# Altium project LPCB235__RLOOP__FCU.PrjPCB (part 5 of 7)

## Sheet LPCB235 - SPI UART - GROUP B1.SchDoc
size A3; Address1: Factory 10; Address2: 9-13 Dingley Avenue, Dandeong, VICTORIA 3175, AUSTRALIA; DocumentNumber: 36; Revision: 1; SheetNumber: 36; SheetTotal: 37; Lockie__PCB_SUB_ASSEMBLY: SPI UARTS B1; Lockie__PCB_ASSEMBLY: FCU PCB; Lockie__LDL: LPCB235; Lockie__PCB_DESCRIPTION: Flight Control Unit
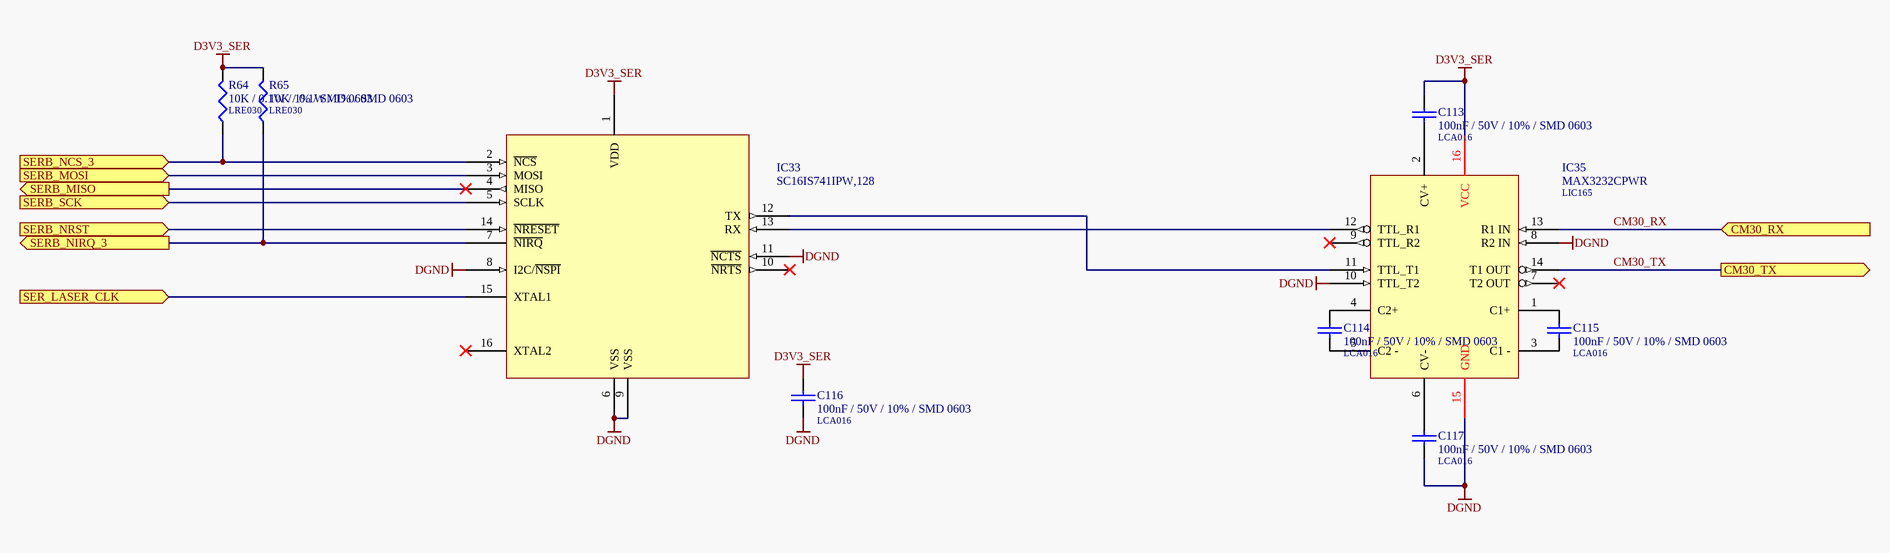
[diagram p20: LPCB235 - SPI UART - GROUP B1.SchDoc]

### Parts
C113  100nF / 50V / 10% / SMD 0603  LDL_NUMBER: LCA016  [LFP011__CC1608-0603-IPC7351_B]
C114  100nF / 50V / 10% / SMD 0603  LDL_NUMBER: LCA016  [LFP011__CC1608-0603-IPC7351_B]
C115  100nF / 50V / 10% / SMD 0603  LDL_NUMBER: LCA016  [LFP011__CC1608-0603-IPC7351_B]
C116  100nF / 50V / 10% / SMD 0603  LDL_NUMBER: LCA016  [LFP011__CC1608-0603-IPC7351_B]
C117  100nF / 50V / 10% / SMD 0603  LDL_NUMBER: LCA016  [LFP011__CC1608-0603-IPC7351_B]
IC33  SC16IS741IPW,128  [LFP049__TSSOP-16]
IC35  MAX3232CPWR  LDL_NUMBER: LIC165  [LFP049__TSSOP-16]
R64  10K / 0.1W / 1% / SMD 0603  LDL_NUMBER: LRE030  [LFP020__CR1608-0603-IPC7351_B]
R65  10K / 0.1W / 1% / SMD 0603  LDL_NUMBER: LRE030  [LFP020__CR1608-0603-IPC7351_B]

### Ports
CM30_RX (in), CM30_TX (out), SER_LASER_CLK (in), SERB_MISO (out), SERB_MOSI (in), SERB_NCS_3 (in), SERB_NIRQ_3 (out), SERB_NRST (in), SERB_SCK (in)

### Nets
D3V3_SER: C113.1 C116.1 IC33.1(VDD) IC35.16(VCC) R64.2 R65.2
DGND: C116.2 C117.2 IC33.6(VSS) IC33.8(I2C/~{NSPI}) IC33.9(VSS) IC33.11(~{NCTS}) IC35.8(R2_IN) IC35.10(TTL_T2) IC35.15(GND)
CM30_RX: IC35.13(R1_IN) ; port CM30_RX
CM30_TX: IC35.14(T1_OUT) ; port CM30_TX
SER_LASER_CLK: IC33.15(XTAL1) ; port SER_LASER_CLK
SERB_MISO: IC33.4(MISO) ; port SERB_MISO
SERB_MOSI: IC33.3(MOSI) ; port SERB_MOSI
SERB_NCS_3: IC33.2(~{NCS}) R64.1 ; port SERB_NCS_3
SERB_NIRQ_3: IC33.7(~{NIRQ}) R65.1 ; port SERB_NIRQ_3
SERB_NRST: IC33.14(~{NRESET}) ; port SERB_NRST
SERB_SCK: IC33.5(SCLK) ; port SERB_SCK
NetC113_2: C113.2 IC35.2(CV+)
NetC114_1: C114.1 IC35.4(C2+)
NetC114_2: C114.2 IC35.5(C2_-)
NetC115_1: C115.1 IC35.1(C1+)
NetC115_2: C115.2 IC35.3(C1_-)
NetC117_1: C117.1 IC35.6(CV-)
NetIC33_12: IC33.12(TX) IC35.11(TTL_T1)
NetIC33_13: IC33.13(RX) IC35.12(TTL_R1)

Not connected (* = marked no-connect by the designer): IC33 10(~{NRTS})* 16(XTAL2)*; IC35 7(T2_OUT)* 9(TTL_R2)*

### Notes on the sheet
- PCB COMPONENT DESCRIPTION
- LDL NUMBER
- Assembly Details
- Size
- Drawing File Name
- Revision
- http://rloop.org
- Scale
- A3
- Sheet Details
- N.T.S
- Sheet:
- Of:

### Library data of the parts
C113-C117 = 100nF / 50V / 10% / SMD 0603: Capacitor, Ceramic Chip, 100nF (0.1uF), 50V, 5%, SMD 0603 [LCA016]; Value: 100n; FMEDA__OPERATING__VOLTAGE_MIN: 0; FMEDA__OPERATING__VOLTAGE_MAX: 3.3; FMEDA__OPERATING__TEMP_MIN: -20; FMEDA__OPERATING__TEMP_TYP: 27; FMEDA__OPERATING__TEMP_MAX: 50; FMEDA__CHANNEL: COM; FMEDA__FUNCTION_IN_SYSTEM: *; FMEDA__OPERATING__VOLTAGE_TYP: 3.3
IC33 = SC16IS741IPW,128: IC, SPI to UART bridge [LIC472]; FMEDA__CHANNEL: COM; LDL_NUMBER: LIC472; FMEDA__FUNCTION_IN_SYSTEM: *
IC35 = MAX3232CPWR: IC, RS232 Line Driver, 3.3V, SMD TSSOP16 [LIC165]; FMEDA__OPERATING__TEMP_MAX: 50; FMEDA__OPERATING__TEMP_MIN: -20; FMEDA__OPERATING__TEMP_TYP: 27; FMEDA__CHANNEL: COM; FMEDA__OPERATING__VOLTAGE_MAX: 3.3; FMEDA__OPERATING__VOLTAGE_MIN: 0; FMEDA__FUNCTION_IN_SYSTEM: *; FMEDA__OPERATING__VOLTAGE_TYP: 3.3
R64 R65 = 10K / 0.1W / 1% / SMD 0603: Resistor, Ceramic Chip, 10K, 0.1W, 1%, SMD 0603 [LRE030]; FMEDA__OPERATING__POWER_MAX: 0; FMEDA__OPERATING__TEMP_MAX: 50; FMEDA__OPERATING__TEMP_MIN: -20; FMEDA__OPERATING__TEMP_TYP: 27; FMEDA__CHANNEL: COM; Value: 10K; FMEDA__OPERATING__POWER_MIN: 0; FMEDA__OPERATING__VOLTAGE_MAX: 0; FMEDA__OPERATING__VOLTAGE_MIN: 0; FMEDA__OPERATING__VOLTAGE_TYP: 0; FMEDA__FUNCTION_IN_SYSTEM: *

## Sheet LPCB235 - DAC.SchDoc
size A3; Address1: Factory 10; Address2: 9-13 Dingley Avenue, Dandeong, VICTORIA 3175, AUSTRALIA; DocumentNumber: 10; Revision: 1; SheetNumber: 10; SheetTotal: 37; Lockie__PCB_SUB_ASSEMBLY: DAC; Lockie__PCB_ASSEMBLY: FCU PCB; Lockie__LDL: LPCB235; Lockie__PCB_DESCRIPTION: Flight Control Unit
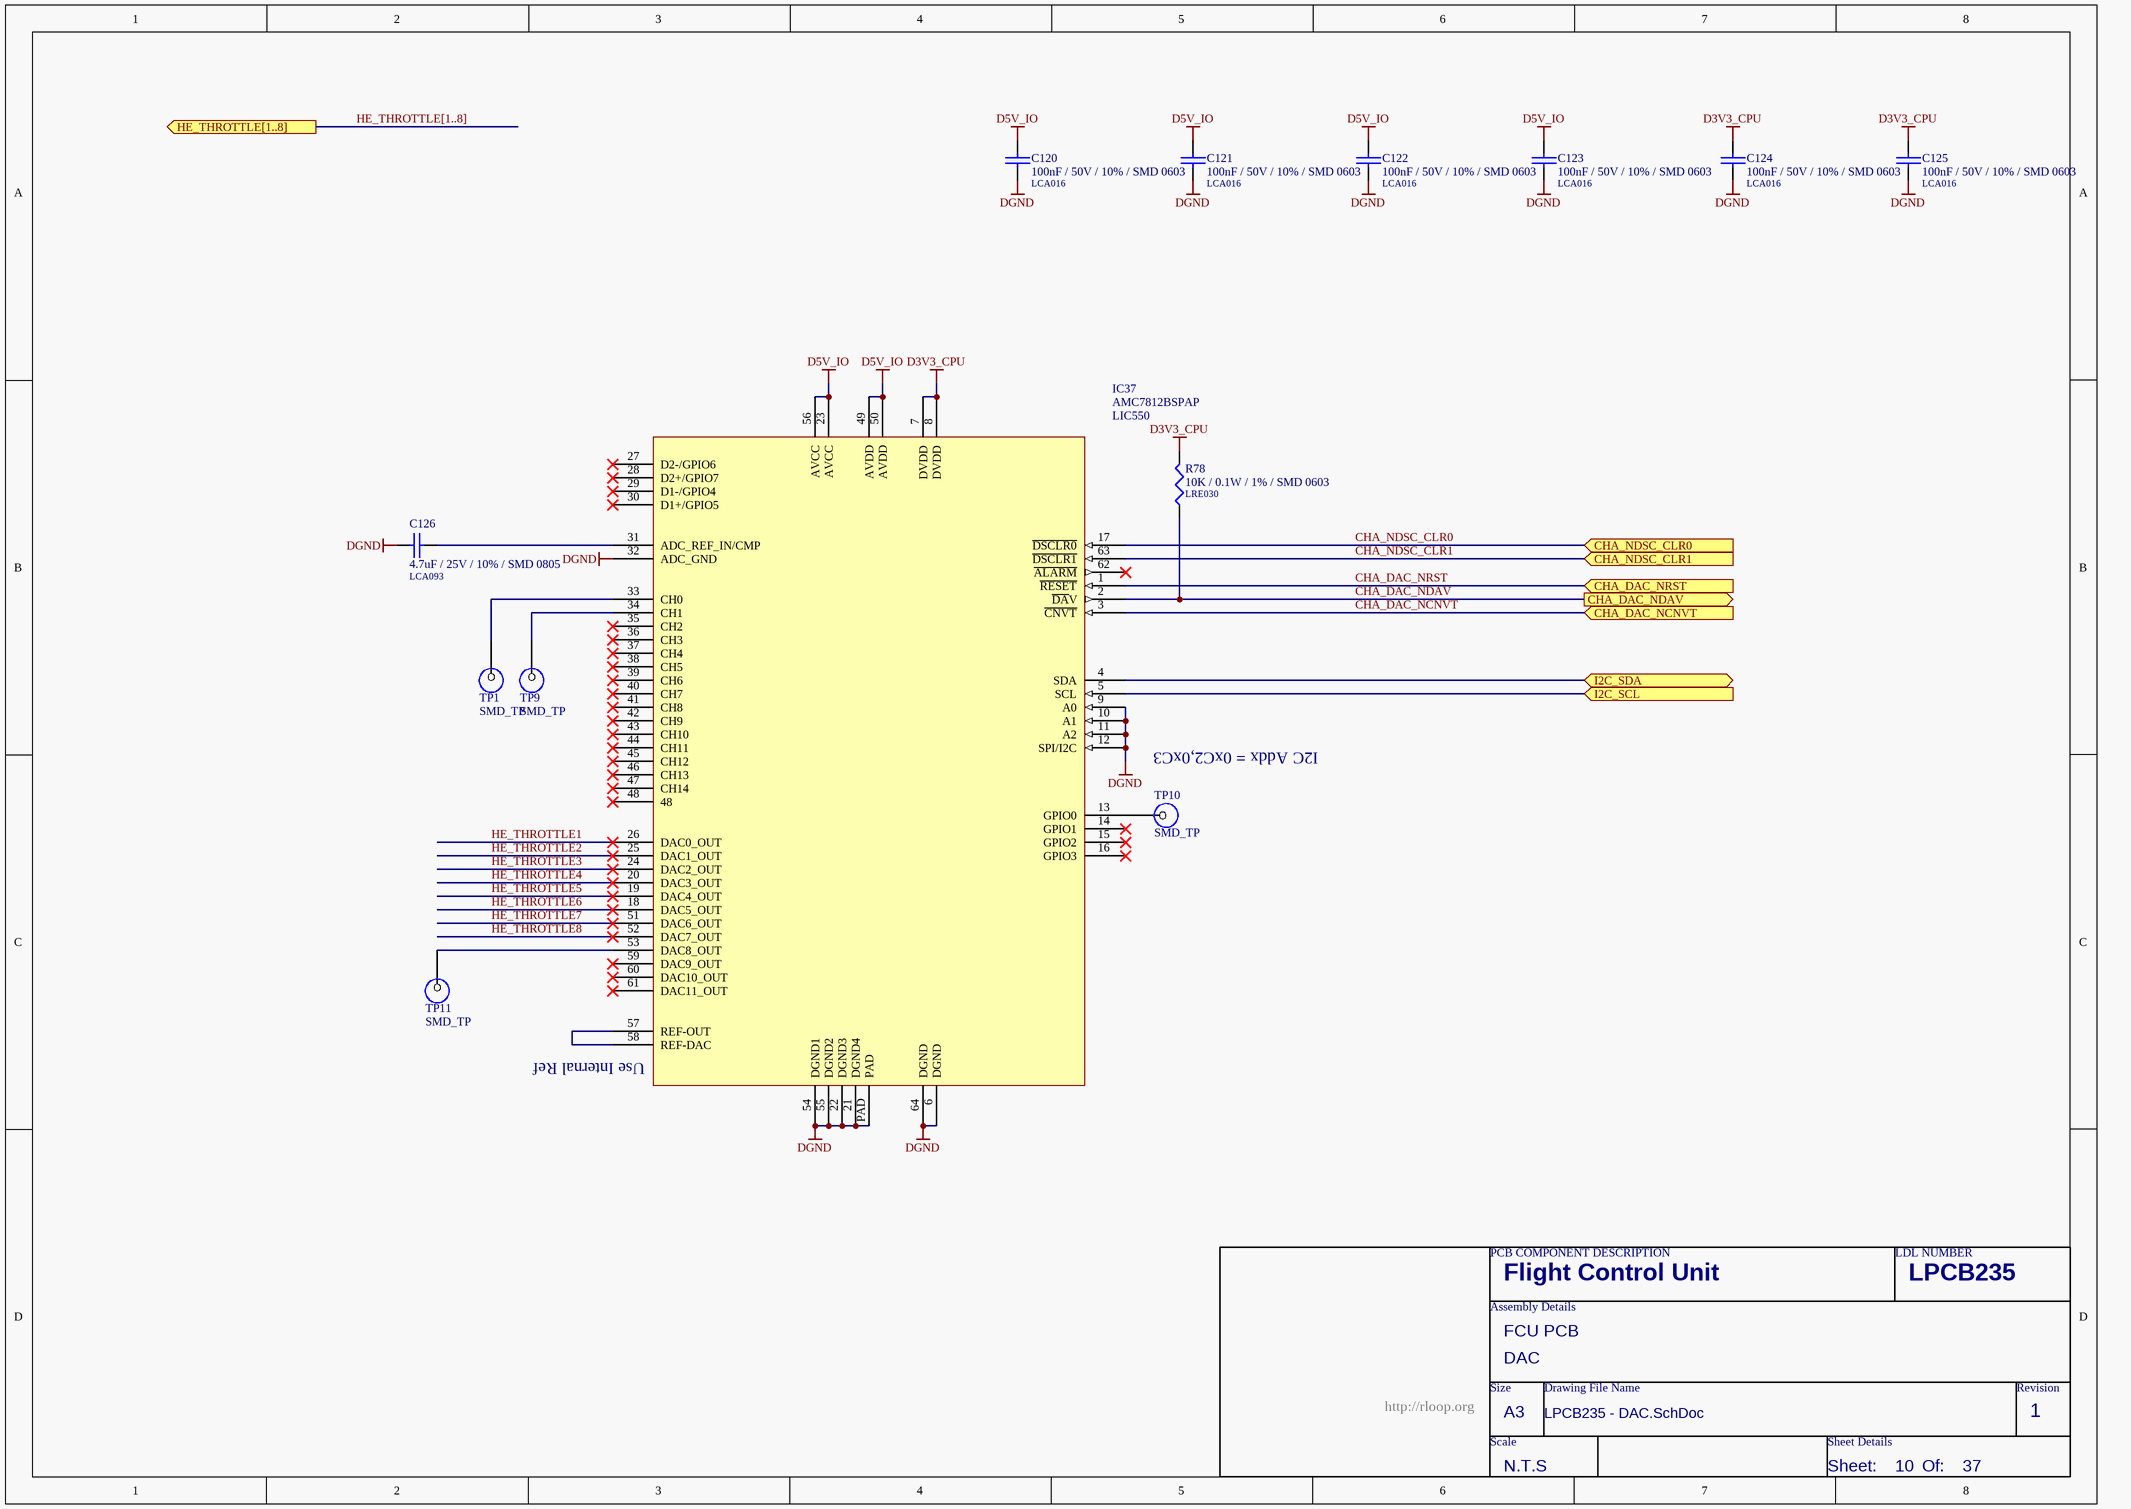
[diagram p21: LPCB235 - DAC.SchDoc]

### Parts
C120  100nF / 50V / 10% / SMD 0603  LDL_NUMBER: LCA016  [LFP011__CC1608-0603-IPC7351_B]
C121  100nF / 50V / 10% / SMD 0603  LDL_NUMBER: LCA016  [LFP011__CC1608-0603-IPC7351_B]
C122  100nF / 50V / 10% / SMD 0603  LDL_NUMBER: LCA016  [LFP011__CC1608-0603-IPC7351_B]
C123  100nF / 50V / 10% / SMD 0603  LDL_NUMBER: LCA016  [LFP011__CC1608-0603-IPC7351_B]
C124  100nF / 50V / 10% / SMD 0603  LDL_NUMBER: LCA016  [LFP011__CC1608-0603-IPC7351_B]
C125  100nF / 50V / 10% / SMD 0603  LDL_NUMBER: LCA016  [LFP011__CC1608-0603-IPC7351_B]
C126  4.7uF / 25V / 10% / SMD 0805  LDL_NUMBER: LCA093  [LFP010__CC2012-0805-IPC7351_B]
IC37  AMC7812BSPAP  LDL_NUMBER: LIC550  [LFP134__H-QFP10X10-64N]
R78  10K / 0.1W / 1% / SMD 0603  LDL_NUMBER: LRE030  [LFP020__CR1608-0603-IPC7351_B]
TP1  SMD_TP  [SMD-TP]  (no BOM)
TP9  SMD_TP  [SMD-TP]  (no BOM)
TP10  SMD_TP  [SMD-TP]  (no BOM)
TP11  SMD_TP  [SMD-TP]  (no BOM)

### Ports
CHA_DAC_NCNVT (in), CHA_DAC_NDAV (out), CHA_DAC_NRST (in), CHA_NDSC_CLR0 (in), CHA_NDSC_CLR1 (in), HE_THROTTLE[1..8] (out), I2C_SCL (in), I2C_SDA (bidir)

### Nets
D3V3_CPU: C124.1 C125.1 IC37.7(DVDD) IC37.8(DVDD) R78.2
D5V_IO: C120.1 C121.1 C122.1 C123.1 IC37.23(AVCC) IC37.49(AVDD) IC37.50(AVDD) IC37.56(AVCC)
DGND: C120.2 C121.2 C122.2 C123.2 C124.2 C125.2 C126.1 IC37.6(DGND) IC37.9(A0) IC37.10(A1) IC37.11(A2) IC37.12(SPI/I2C) IC37.21(DGND4) IC37.22(DGND3) IC37.32(ADC_GND) IC37.54(DGND1) IC37.55(DGND2) IC37.64(DGND) IC37.PAD
CHA_DAC_NCNVT: IC37.3(~{CNVT}) ; port CHA_DAC_NCNVT
CHA_DAC_NDAV: IC37.2(~{DA}V) R78.1 ; port CHA_DAC_NDAV
CHA_DAC_NRST: IC37.1(~{RESET}) ; port CHA_DAC_NRST
CHA_NDSC_CLR0: IC37.17(~{DSCLR0}) ; port CHA_NDSC_CLR0
CHA_NDSC_CLR1: IC37.63(~{DSCLR1}) ; port CHA_NDSC_CLR1
HE_THROTTLE1: IC37.26(DAC0_OUT)
HE_THROTTLE2: IC37.25(DAC1_OUT)
HE_THROTTLE3: IC37.24(DAC2_OUT)
HE_THROTTLE4: IC37.20(DAC3_OUT)
HE_THROTTLE5: IC37.19(DAC4_OUT)
HE_THROTTLE6: IC37.18(DAC5_OUT)
HE_THROTTLE7: IC37.51(DAC6_OUT)
HE_THROTTLE8: IC37.52(DAC7_OUT)
I2C_SCL: IC37.5(SCL) ; port I2C_SCL
I2C_SDA: IC37.4(SDA) ; port I2C_SDA
NetC126_2: C126.2 IC37.31(ADC_REF_IN/CMP)
NetIC37_13: IC37.13(GPIO0) TP10.1
NetIC37_33: IC37.33(CH0) TP1.1
NetIC37_34: IC37.34(CH1) TP9.1
NetIC37_53: IC37.53(DAC8_OUT) TP11.1
NetIC37_57: IC37.57(REF-OUT) IC37.58(REF-DAC)

Not connected (* = marked no-connect by the designer): IC37 14(GPIO1)* 15(GPIO2)* 16(GPIO3)* 27(D2-/GPIO6)* 28(D2+/GPIO7)* 29(D1-/GPIO4)* 30(D1+/GPIO5)* 35(CH2)* 36(CH3)* 37(CH4)* 38(CH5)* 39(CH6)* 40(CH7)* 41(CH8)* 42(CH9)* 43(CH10)* 44(CH11)* 45(CH12)* 46(CH13)* 47(CH14)* 48* 59(DAC9_OUT)* 60(DAC10_OUT)* 61(DAC11_OUT)* 62(~{ALARM})*

### Buses and harness runs
bus HE_THROTTLE[1..8] = port HE_THROTTLE[1..8]

### Notes on the sheet
- I2C Addx = 0xC2,0xC3
- (near IC37) Use Internal Ref
- PCB COMPONENT DESCRIPTION
- LDL NUMBER
- Assembly Details
- Size
- Drawing File Name
- Revision
- http://rloop.org
- Scale
- A3
- Sheet Details
- N.T.S
- Sheet:
- Of:

### Library data of the parts
C120-C125 = 100nF / 50V / 10% / SMD 0603: as C113-C117 on sheet LPCB235 - SPI UART - GROUP B1; FMEDA__FUNCTION_IN_SYSTEM: *; FMEDA__OPERATING__VOLTAGE_TYP: 3.3
C126 = 4.7uF / 25V / 10% / SMD 0805: Capacitor, Ceramic Chip, 4.7uF, 25V, 10%, SMD 0805 [LCA093]; Value: 4.7u; FMEDA__OPERATING__TEMP_MAX: 50; FMEDA__OPERATING__TEMP_MIN: -20; FMEDA__OPERATING__TEMP_TYP: 27; FMEDA__OPERATING__VOLTAGE_MAX: 0; FMEDA__CHANNEL: COM; FMEDA__OPERATING__VOLTAGE_MIN: 0; FMEDA__OPERATING__VOLTAGE_TYP: 0; FMEDA__FUNCTION_IN_SYSTEM: *
IC37 = AMC7812BSPAP: IC, ADC / DAC, SMD [LIC550]
R78 = 10K / 0.1W / 1% / SMD 0603: as R64 on sheet LPCB235 - SPI UART - GROUP B1; Value: 10K; FMEDA__OPERATING__POWER_MIN: 0; FMEDA__OPERATING__VOLTAGE_MAX: 0; FMEDA__OPERATING__VOLTAGE_MIN: 0; FMEDA__OPERATING__VOLTAGE_TYP: 0; FMEDA__FUNCTION_IN_SYSTEM: *
TP1 TP9-TP11 = SMD_TP: SMD Test Point; FMEDA__CHANNEL: COM; FMEDA__OPERATING__CURRENT_MAX: 0; FMEDA__OPERATING__TEMP_MAX: 50; FMEDA__OPERATING__TEMP_MIN: -20; FMEDA__OPERATING__TEMP_TYP: 27; FMEDA__OPERATING__VOLTAGE_MAX: 16; FMEDA__OPERATING__VOLTAGE_TYP: 12; FMEDA__OPERATING__CURRENT_MIN: 0; FMEDA__OPERATING__CURRENT_TYP: 0; FMEDA__OPERATING__VOLTAGE_MIN: 0

## Sheet LPCB235 - HE THROTTLES.SchDoc
size A3; Address1: Factory 10; Address2: 9-13 Dingley Avenue, Dandeong, VICTORIA 3175, AUSTRALIA; DocumentNumber: 12; Revision: 1; SheetNumber: 12; SheetTotal: 37; Lockie__PCB_SUB_ASSEMBLY: HE Throttle Channels; Lockie__PCB_ASSEMBLY: FCU PCB; Lockie__LDL: LPCB235; Lockie__PCB_DESCRIPTION: Flight Control Unit
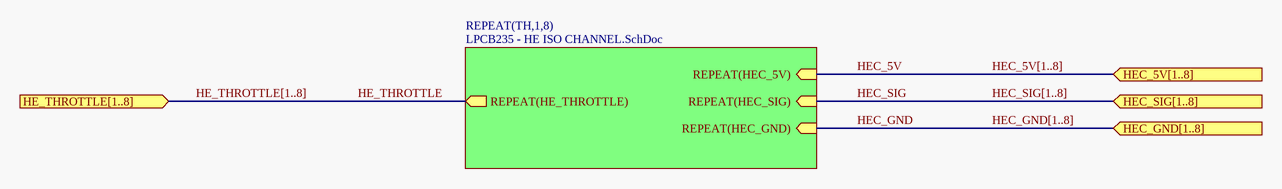
[diagram p22: LPCB235 - HE THROTTLES.SchDoc]

### Sub-sheets
REPEAT(TH,1,8) = LPCB235 - HE ISO CHANNEL.SchDoc: REPEAT(HE_THROTTLE) (out), REPEAT(HEC_5V) (in), REPEAT(HEC_GND) (in), REPEAT(HEC_SIG) (in)

### Ports
HE_THROTTLE[1..8] (in), HEC_5V[1..8] (in), HEC_GND[1..8] (in), HEC_SIG[1..8] (in)

### Nets
HE_THROTTLE: sheet REPEAT(TH,1,8)/REPEAT(HE_THROTTLE)
HEC_5V: sheet REPEAT(TH,1,8)/REPEAT(HEC_5V)
HEC_GND: sheet REPEAT(TH,1,8)/REPEAT(HEC_GND)
HEC_SIG: sheet REPEAT(TH,1,8)/REPEAT(HEC_SIG)

### Buses and harness runs
bus HE_THROTTLE[1..8] = port HE_THROTTLE[1..8]
bus HEC_5V[1..8] = port HEC_5V[1..8]
bus HEC_GND[1..8] = port HEC_GND[1..8]
bus HEC_SIG[1..8] = port HEC_SIG[1..8]

### Notes on the sheet
- PCB COMPONENT DESCRIPTION
- LDL NUMBER
- Assembly Details
- Size
- Drawing File Name
- Revision
- http://rloop.org
- Scale
- A3
- Sheet Details
- N.T.S
- Sheet:
- Of:

## Sheet LPCB235 - HE ISO CHANNEL.SchDoc
size A3; Address1: Factory 10; Address2: 9-13 Dingley Avenue, Dandeong, VICTORIA 3175, AUSTRALIA; DocumentNumber: 13; Revision: 1; SheetNumber: 13; SheetTotal: 37; Lockie__PCB_SUB_ASSEMBLY: HE Isolated Channels; Lockie__PCB_ASSEMBLY: FCU PCB; Lockie__LDL: LPCB235; Lockie__PCB_DESCRIPTION: Flight Control Unit
Used 8 times, as channels U_LPCB235 - HE THROTTLES/TH1, U_LPCB235 - HE THROTTLES/TH2, U_LPCB235 - HE THROTTLES/TH3, U_LPCB235 - HE THROTTLES/TH4, U_LPCB235 - HE THROTTLES/TH5, U_LPCB235 - HE THROTTLES/TH6, U_LPCB235 - HE THROTTLES/TH7, U_LPCB235 - HE THROTTLES/TH8. Parts and nets are listed once, with the designators drawn on the sheet.
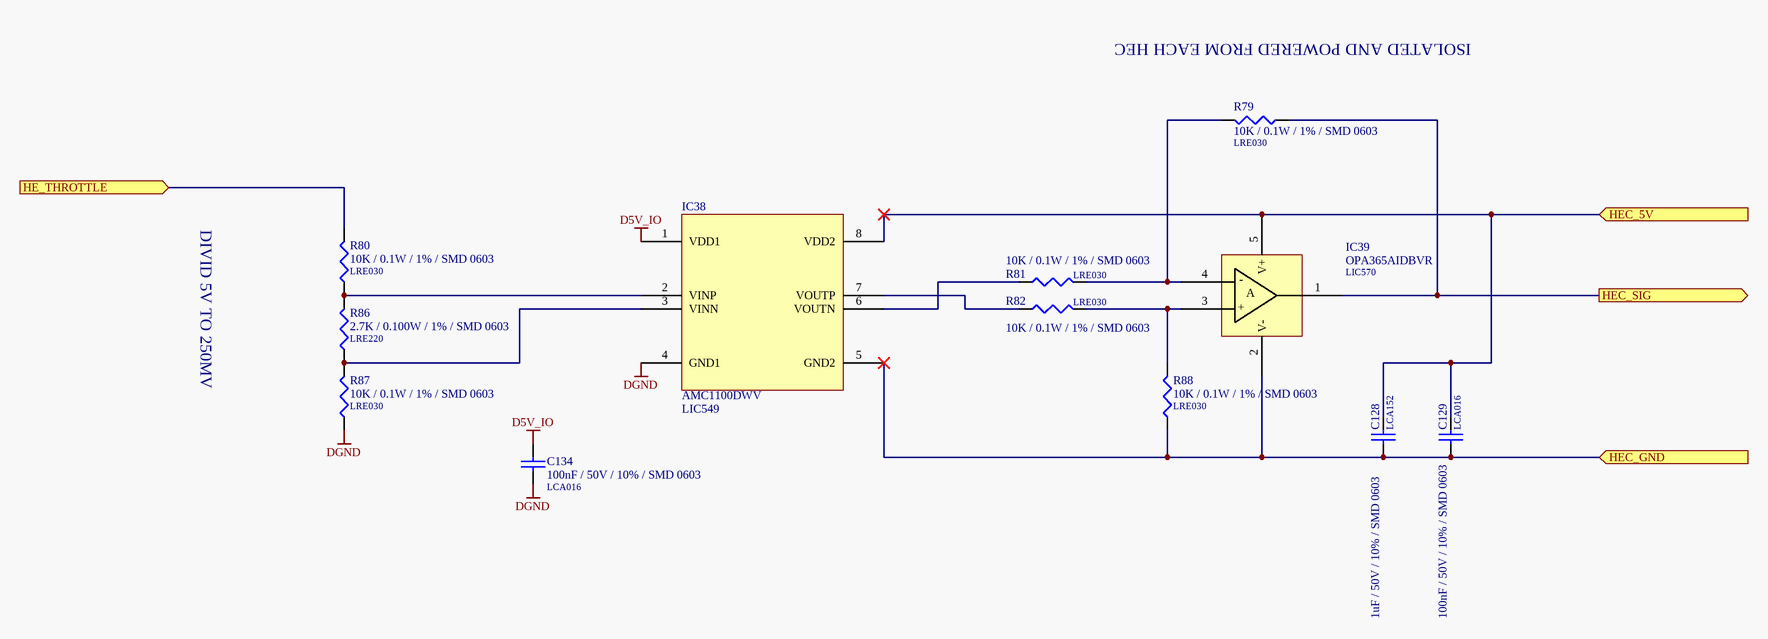
[diagram p23: LPCB235 - HE ISO CHANNEL.SchDoc]

### Parts
C128  1uF / 50V / 10% / SMD 0603  LDL_NUMBER: LCA152  [LFP011__CC1608-0603-IPC7351_B]
C129  100nF / 50V / 10% / SMD 0603  LDL_NUMBER: LCA016  [LFP011__CC1608-0603-IPC7351_B]
C134  100nF / 50V / 10% / SMD 0603  LDL_NUMBER: LCA016  [LFP011__CC1608-0603-IPC7351_B]
IC38  AMC1100DWV  LDL_NUMBER: LIC549  [LFP150__DWV0008A]
IC39  OPA365AIDBVR  LDL_NUMBER: LIC570  [LFP114__R-PDSO-G5]
R79  10K / 0.1W / 1% / SMD 0603  LDL_NUMBER: LRE030  [LFP020__CR1608-0603-IPC7351_B]
R80  10K / 0.1W / 1% / SMD 0603  LDL_NUMBER: LRE030  [LFP020__CR1608-0603-IPC7351_B]
R81  10K / 0.1W / 1% / SMD 0603  LDL_NUMBER: LRE030  [LFP020__CR1608-0603-IPC7351_B]
R82  10K / 0.1W / 1% / SMD 0603  LDL_NUMBER: LRE030  [LFP020__CR1608-0603-IPC7351_B]
R86  2.7K / 0.100W / 1% / SMD 0603  LDL_NUMBER: LRE220  [LFP020__CR1608-0603-IPC7351_B]
R87  10K / 0.1W / 1% / SMD 0603  LDL_NUMBER: LRE030  [LFP020__CR1608-0603-IPC7351_B]
R88  10K / 0.1W / 1% / SMD 0603  LDL_NUMBER: LRE030  [LFP020__CR1608-0603-IPC7351_B]

### Ports
HE_THROTTLE (in), HEC_5V (in), HEC_GND (in), HEC_SIG (out)

### Nets
D5V_IO: C134.1 IC38.1(VDD1)
DGND: C134.2 IC38.4(GND1) R87.1
HE_THROTTLE: R80.2 ; port HE_THROTTLE
HEC_5V: C128.1 C129.1 IC38.8(VDD2) IC39.5(V+) ; port HEC_5V
HEC_GND: C128.2 C129.2 IC38.5(GND2) IC39.2(V-) R88.1 ; port HEC_GND
HEC_SIG: IC39.1(OUT_A) R79.1 ; port HEC_SIG
NetIC38_2: IC38.2(VINP) R80.1 R86.2
NetIC38_3: IC38.3(VINN) R86.1 R87.2
NetIC38_6: IC38.6(VOUTN) R81.1
NetIC38_7: IC38.7(VOUTP) R82.1
NetIC39_3: IC39.3(+IN_A) R82.2 R88.2
NetIC39_4: IC39.4(-IN_A) R79.2 R81.2

### Channels
U_LPCB235 - HE THROTTLES/TH1: designators end in _TH1; ports HE_THROTTLE=HE_THROTTLE1 HEC_5V=HEC_5V1 HEC_GND=HEC_GND1 HEC_SIG=HEC_SIG1
U_LPCB235 - HE THROTTLES/TH2: designators end in _TH2; ports HE_THROTTLE=HE_THROTTLE2 HEC_5V=HEC_5V2 HEC_GND=HEC_GND2 HEC_SIG=HEC_SIG2
U_LPCB235 - HE THROTTLES/TH3: designators end in _TH3; ports HE_THROTTLE=HE_THROTTLE3 HEC_5V=HEC_5V3 HEC_GND=HEC_GND3 HEC_SIG=HEC_SIG3
U_LPCB235 - HE THROTTLES/TH4: designators end in _TH4; ports HE_THROTTLE=HE_THROTTLE4 HEC_5V=HEC_5V4 HEC_GND=HEC_GND4 HEC_SIG=HEC_SIG4
U_LPCB235 - HE THROTTLES/TH5: designators end in _TH5; ports HE_THROTTLE=HE_THROTTLE5 HEC_5V=HEC_5V5 HEC_GND=HEC_GND5 HEC_SIG=HEC_SIG5
U_LPCB235 - HE THROTTLES/TH6: designators end in _TH6; ports HE_THROTTLE=HE_THROTTLE6 HEC_5V=HEC_5V6 HEC_GND=HEC_GND6 HEC_SIG=HEC_SIG6
U_LPCB235 - HE THROTTLES/TH7: designators end in _TH7; ports HE_THROTTLE=HE_THROTTLE7 HEC_5V=HEC_5V7 HEC_GND=HEC_GND7 HEC_SIG=HEC_SIG7
U_LPCB235 - HE THROTTLES/TH8: designators end in _TH8; ports HE_THROTTLE=HE_THROTTLE8 HEC_5V=HEC_5V8 HEC_GND=HEC_GND8 HEC_SIG=HEC_SIG8

### Notes on the sheet
- ISOLATED AND POWERED FROM EACH HEC
- DIVID 5V TO 250MV
- PCB COMPONENT DESCRIPTION
- LDL NUMBER
- Assembly Details
- Size
- Drawing File Name
- Revision
- http://rloop.org
- Scale
- A3
- Sheet Details
- N.T.S
- Sheet:
- Of:
- (in symbol OPA365AIDBVR) -; A; +

### Library data of the parts
C128 = 1uF / 50V / 10% / SMD 0603: Capacitor, Ceramic Chip, 1uF, 50V, 10% (X5R), SMD 0603 [LCA152]; Value: 1u; FMEDA__OPERATING__VOLTAGE_MAX: 50; FMEDA__OPERATING__VOLTAGE_MIN: 0; FMEDA__OPERATING__TEMP_MAX: 85; FMEDA__OPERATING__TEMP_MIN: -55; FMEDA__OPERATING__TEMP_TYP: 27; FMEDA__CHANNEL: COM; FMEDA__OPERATING__VOLTAGE_TYP: 0; FMEDA__FUNCTION_IN_SYSTEM: *
C129 C134 = 100nF / 50V / 10% / SMD 0603: as C113-C117 on sheet LPCB235 - SPI UART - GROUP B1; FMEDA__FUNCTION_IN_SYSTEM: *; FMEDA__OPERATING__VOLTAGE_TYP: 3.3
IC38 = AMC1100DWV: IC, Isolation Amplifier, SMD SOIC8 [LIC549]
IC39 = OPA365AIDBVR: IC, OpAmp, 1-Channel, Low Noise, SMD SOT-23-5 [LIC570]; FMEDA__OPERATING__TEMP_MAX: 125; FMEDA__OPERATING__TEMP_MIN: -40; FMEDA__OPERATING__TEMP_TYP: 27; FMEDA__CHANNEL: COM; FMEDA__FUNCTION_IN_SYSTEM: *
R79-R82 R87 R88 = 10K / 0.1W / 1% / SMD 0603: as R64 on sheet LPCB235 - SPI UART - GROUP B1; Value: 10K; FMEDA__OPERATING__POWER_MIN: 0; FMEDA__OPERATING__VOLTAGE_MAX: 0; FMEDA__OPERATING__VOLTAGE_MIN: 0; FMEDA__OPERATING__VOLTAGE_TYP: 0; FMEDA__FUNCTION_IN_SYSTEM: *
R86 = 2.7K / 0.100W / 1% / SMD 0603: Resistor, Thick Film, 2.7K, 0.100W, 75V, 1%, SMD 0603 [LRE220]; FMEDA__OPERATING__POWER_MAX: 0.1; FMEDA__OPERATING__POWER_MIN: 0; FMEDA__OPERATING__VOLTAGE_MAX: 75; FMEDA__OPERATING__TEMP_MAX: 155; FMEDA__OPERATING__TEMP_MIN: -55; FMEDA__OPERATING__TEMP_TYP: 27; FMEDA__CHANNEL: COM; VALUE: 2.7K; FMEDA__OPERATING__VOLTAGE_MIN: 0; FMEDA__OPERATING__VOLTAGE_TYP: 75; FMEDA__FUNCTION_IN_SYSTEM: *

## Sheet LPCB235 - WATCHDOG.SchDoc
size A3; Address1: Factory 10; Address2: 9-13 Dingley Avenue, Dandeong, VICTORIA 3175, AUSTRALIA; DocumentNumber: 37; Revision: 1; SheetNumber: 37; SheetTotal: 37; Lockie__PCB_SUB_ASSEMBLY: Watchdog; Lockie__PCB_ASSEMBLY: FCU PCB; Lockie__LDL: LPCB235; Lockie__PCB_DESCRIPTION: Flight Control Unit
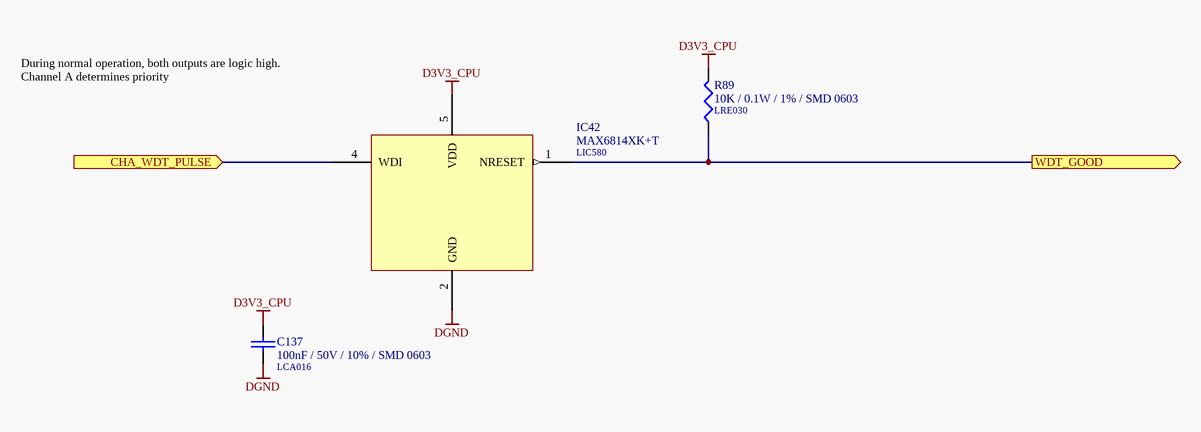
[diagram p24: LPCB235 - WATCHDOG.SchDoc]

### Parts
C137  100nF / 50V / 10% / SMD 0603  LDL_NUMBER: LCA016  [LFP011__CC1608-0603-IPC7351_B]
IC42  MAX6814XK+T  LDL_NUMBER: LIC580  [LFP047__SOT353]
R89  10K / 0.1W / 1% / SMD 0603  LDL_NUMBER: LRE030  [LFP020__CR1608-0603-IPC7351_B]

### Ports
CHA_WDT_PULSE (in), WDT_GOOD (out)

### Nets
D3V3_CPU: C137.1 IC42.5(VDD) R89.2
DGND: C137.2 IC42.2(GND)
CHA_WDT_PULSE: IC42.4(WDI) ; port CHA_WDT_PULSE
WDT_GOOD: IC42.1(NRESET) R89.1 ; port WDT_GOOD

### Notes on the sheet
- During normal operation, both outputs are logic high.
  Channel A determines priority
- PCB COMPONENT DESCRIPTION
- LDL NUMBER
- Assembly Details
- Size
- Drawing File Name
- Revision
- http://rloop.org
- Scale
- A3
- Sheet Details
- N.T.S
- Sheet:
- Of:

### Library data of the parts
C137 = 100nF / 50V / 10% / SMD 0603: as C113-C117 on sheet LPCB235 - SPI UART - GROUP B1; FMEDA__FUNCTION_IN_SYSTEM: *; FMEDA__OPERATING__VOLTAGE_TYP: 3.3
IC42 = MAX6814XK+T: IC, Watchdog, SMD [LIC580]; FMEDA__OPERATING__TEMP_MIN: -20; FMEDA__OPERATING__TEMP_TYP: 27; FMEDA__OPERATING__TEMP_MAX: 50; FMEDA__OPERATING__VOLTAGE_MIN: 0; FMEDA__OPERATING__VOLTAGE_TYP: 3.3; FMEDA__CHANNEL: COM; FMEDA__FUNCTION_IN_SYSTEM: *; FMEDA__OPERATING__VOLTAGE_MAX: 3.3
R89 = 10K / 0.1W / 1% / SMD 0603: as R64 on sheet LPCB235 - SPI UART - GROUP B1; Value: 10K; FMEDA__OPERATING__POWER_MIN: 0; FMEDA__OPERATING__VOLTAGE_MAX: 0; FMEDA__OPERATING__VOLTAGE_MIN: 0; FMEDA__OPERATING__VOLTAGE_TYP: 0; FMEDA__FUNCTION_IN_SYSTEM: *

## Sheet LPCB235 - BRAKE FAILSAFE.SchDoc
size A3; Address1: Factory 10; Address2: 9-13 Dingley Avenue, Dandeong, VICTORIA 3175, AUSTRALIA; DocumentNumber: 7; Revision: 1; SheetNumber: 7; SheetTotal: 37; Lockie__PCB_SUB_ASSEMBLY: Brake Failsafe System; Lockie__PCB_ASSEMBLY: FCU PCB; Lockie__LDL: LPCB235; Lockie__PCB_DESCRIPTION: Flight Control Unit
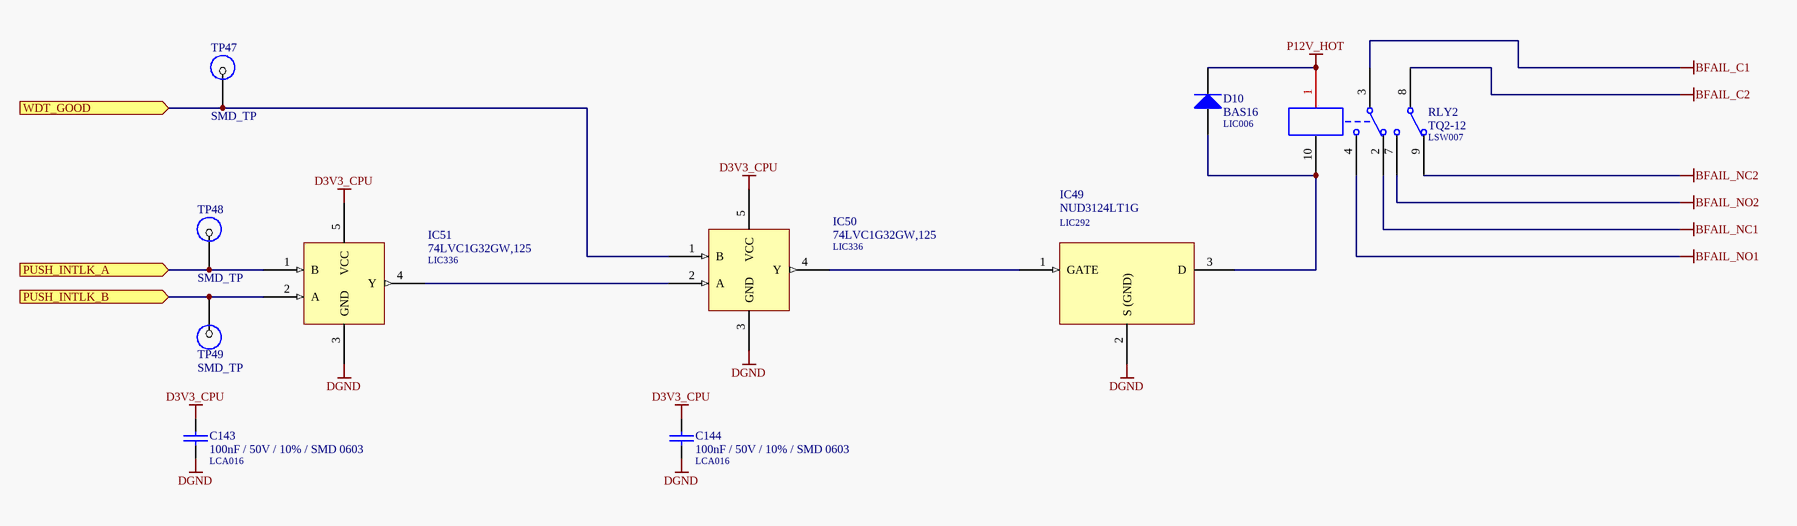
[diagram p25: LPCB235 - BRAKE FAILSAFE.SchDoc]

### Parts
C143  100nF / 50V / 10% / SMD 0603  LDL_NUMBER: LCA016  [LFP011__CC1608-0603-IPC7351_B]
C144  100nF / 50V / 10% / SMD 0603  LDL_NUMBER: LCA016  [LFP011__CC1608-0603-IPC7351_B]
D10  BAS16  LDL_NUMBER: LIC006  [LFP021__SOT23]
IC49  NUD3124LT1G  LDL_NUMBER: LIC292  [LFP021__SOT23]
IC50  74LVC1G32GW,125  LDL_NUMBER: LIC336  [LFP047__SOT353]
IC51  74LVC1G32GW,125  LDL_NUMBER: LIC336  [LFP047__SOT353]
RLY2  TQ2-12  LDL_NUMBER: LSW007  [TQ2]
TP47  SMD_TP  [SMD-TP]  (no BOM)
TP48  SMD_TP  [SMD-TP]  (no BOM)
TP49  SMD_TP  [SMD-TP]  (no BOM)

### Ports
PUSH_INTLK_A (in), PUSH_INTLK_B (in), WDT_GOOD (in)

### Nets
BFAIL_C1: RLY2.3
BFAIL_C2: RLY2.8
BFAIL_NC1: RLY2.2
BFAIL_NC2: RLY2.9
BFAIL_NO1: RLY2.4
BFAIL_NO2: RLY2.7
D3V3_CPU: C143.1 C144.1 IC50.5(VCC) IC51.5(VCC)
DGND: C143.2 C144.2 IC49.2(S_(GND)) IC50.3(GND) IC51.3(GND)
P12V_HOT: D10.3(K) RLY2.1
PUSH_INTLK_A: IC51.1(B) TP48.1 ; port PUSH_INTLK_A
PUSH_INTLK_B: IC51.2(A) TP49.1 ; port PUSH_INTLK_B
WDT_GOOD: IC50.1(B) TP47.1 ; port WDT_GOOD
NetD10_1: D10.1(A) IC49.3(D) RLY2.10
NetIC49_1: IC49.1(GATE) IC50.4(Y)
NetIC50_2: IC50.2(A) IC51.4(Y)

### Notes on the sheet
- PCB COMPONENT DESCRIPTION
- LDL NUMBER
- Assembly Details
- Size
- Drawing File Name
- Revision
- http://rloop.org
- Scale
- A3
- Sheet Details
- N.T.S
- Sheet:
- Of:

### Library data of the parts
C143 C144 = 100nF / 50V / 10% / SMD 0603: as C113-C117 on sheet LPCB235 - SPI UART - GROUP B1; FMEDA__FUNCTION_IN_SYSTEM: *; FMEDA__OPERATING__VOLTAGE_TYP: 3.3
D10 = BAS16: Diode, Small Signal, 0.2A, 85V, SMD SOT-23 [LIC006]; FMEDA__OPERATING__CURRENT_MIN: 0; FMEDA__OPERATING__TEMP_MIN: -20; FMEDA__OPERATING__TEMP_TYP: 27; FMEDA__OPERATING__TEMP_MAX: 50; FMEDA__CHANNEL: COM; FMEDA__OPERATING__CURRENT_MAX: 0; FMEDA__OPERATING__VOLTAGE_MIN: 0; FMEDA__OPERATING__VOLTAGE_MAX: 0; FMEDA__FUNCTION_IN_SYSTEM: *; FMEDA__OPERATING__CURRENT_TYP: 0; FMEDA__OPERATING__VOLTAGE_TYP: 0
IC49 = NUD3124LT1G: IC, Relay Driver, 28V Industrial, SMD SOT23 [LIC292]; FMEDA__OPERATING__TEMP_MIN: -20; FMEDA__OPERATING__TEMP_TYP: 27; FMEDA__OPERATING__TEMP_MAX: 50; FMEDA__OPERATING__VOLTAGE_MIN: 0; FMEDA__OPERATING__VOLTAGE_TYP: 13; FMEDA__OPERATING__VOLTAGE_MAX: 18; FMEDA__OPERATING__POWER_TYP: 0.1; FMEDA__OPERATING__POWER_MAX: 0.15; FMEDA__CHANNEL: COM; FMEDA__FUNCTION_IN_SYSTEM: *; FMEDA__OPERATING__POWER_MIN: 0
IC50 IC51 = 74LVC1G32GW,125: IC, Logic OR Gate, Single 2 Input, SMD SOT353 [LIC336]; FMEDA__OPERATING__TEMP_MAX: 50; FMEDA__OPERATING__TEMP_MIN: -20; FMEDA__OPERATING__TEMP_TYP: 27; FMEDA__OPERATING__VOLTAGE_MAX: 0; FMEDA__CHANNEL: COM; FMEDA__FUNCTION_IN_SYSTEM: *; FMEDA__OPERATING__VOLTAGE_MIN: 0; FMEDA__OPERATING__VOLTAGE_TYP: 0
RLY2 = TQ2-12: Relay, DPDT, Non Latching, 12VDC Coil, 2A Rating, PTH; FMEDA__CHANNEL: COM; FMEDA__OPERATING__TEMP_MAX: 50; FMEDA__OPERATING__TEMP_MIN: -20; FMEDA__OPERATING__TEMP_TYP: 27; Revision: July-2002: Re-released for DXP Platform.
TP47-TP49 = SMD_TP: as TP1 on sheet LPCB235 - DAC; FMEDA__OPERATING__CURRENT_MIN: 0; FMEDA__OPERATING__CURRENT_TYP: 0; FMEDA__OPERATING__VOLTAGE_MIN: 0

## Sheet LPCB235 - ANALOG CONNECTOR.SchDoc
size A3; Address1: Factory 10; Address2: 9-13 Dingley Avenue, Dandeong, VICTORIA 3175, AUSTRALIA; DocumentNumber: 2; Revision: 1; SheetNumber: 2; SheetTotal: 37; Lockie__PCB_SUB_ASSEMBLY: Connector; Lockie__PCB_ASSEMBLY: FCU PCB; Lockie__LDL: LPCB235; Lockie__PCB_DESCRIPTION: Flight Control Unit
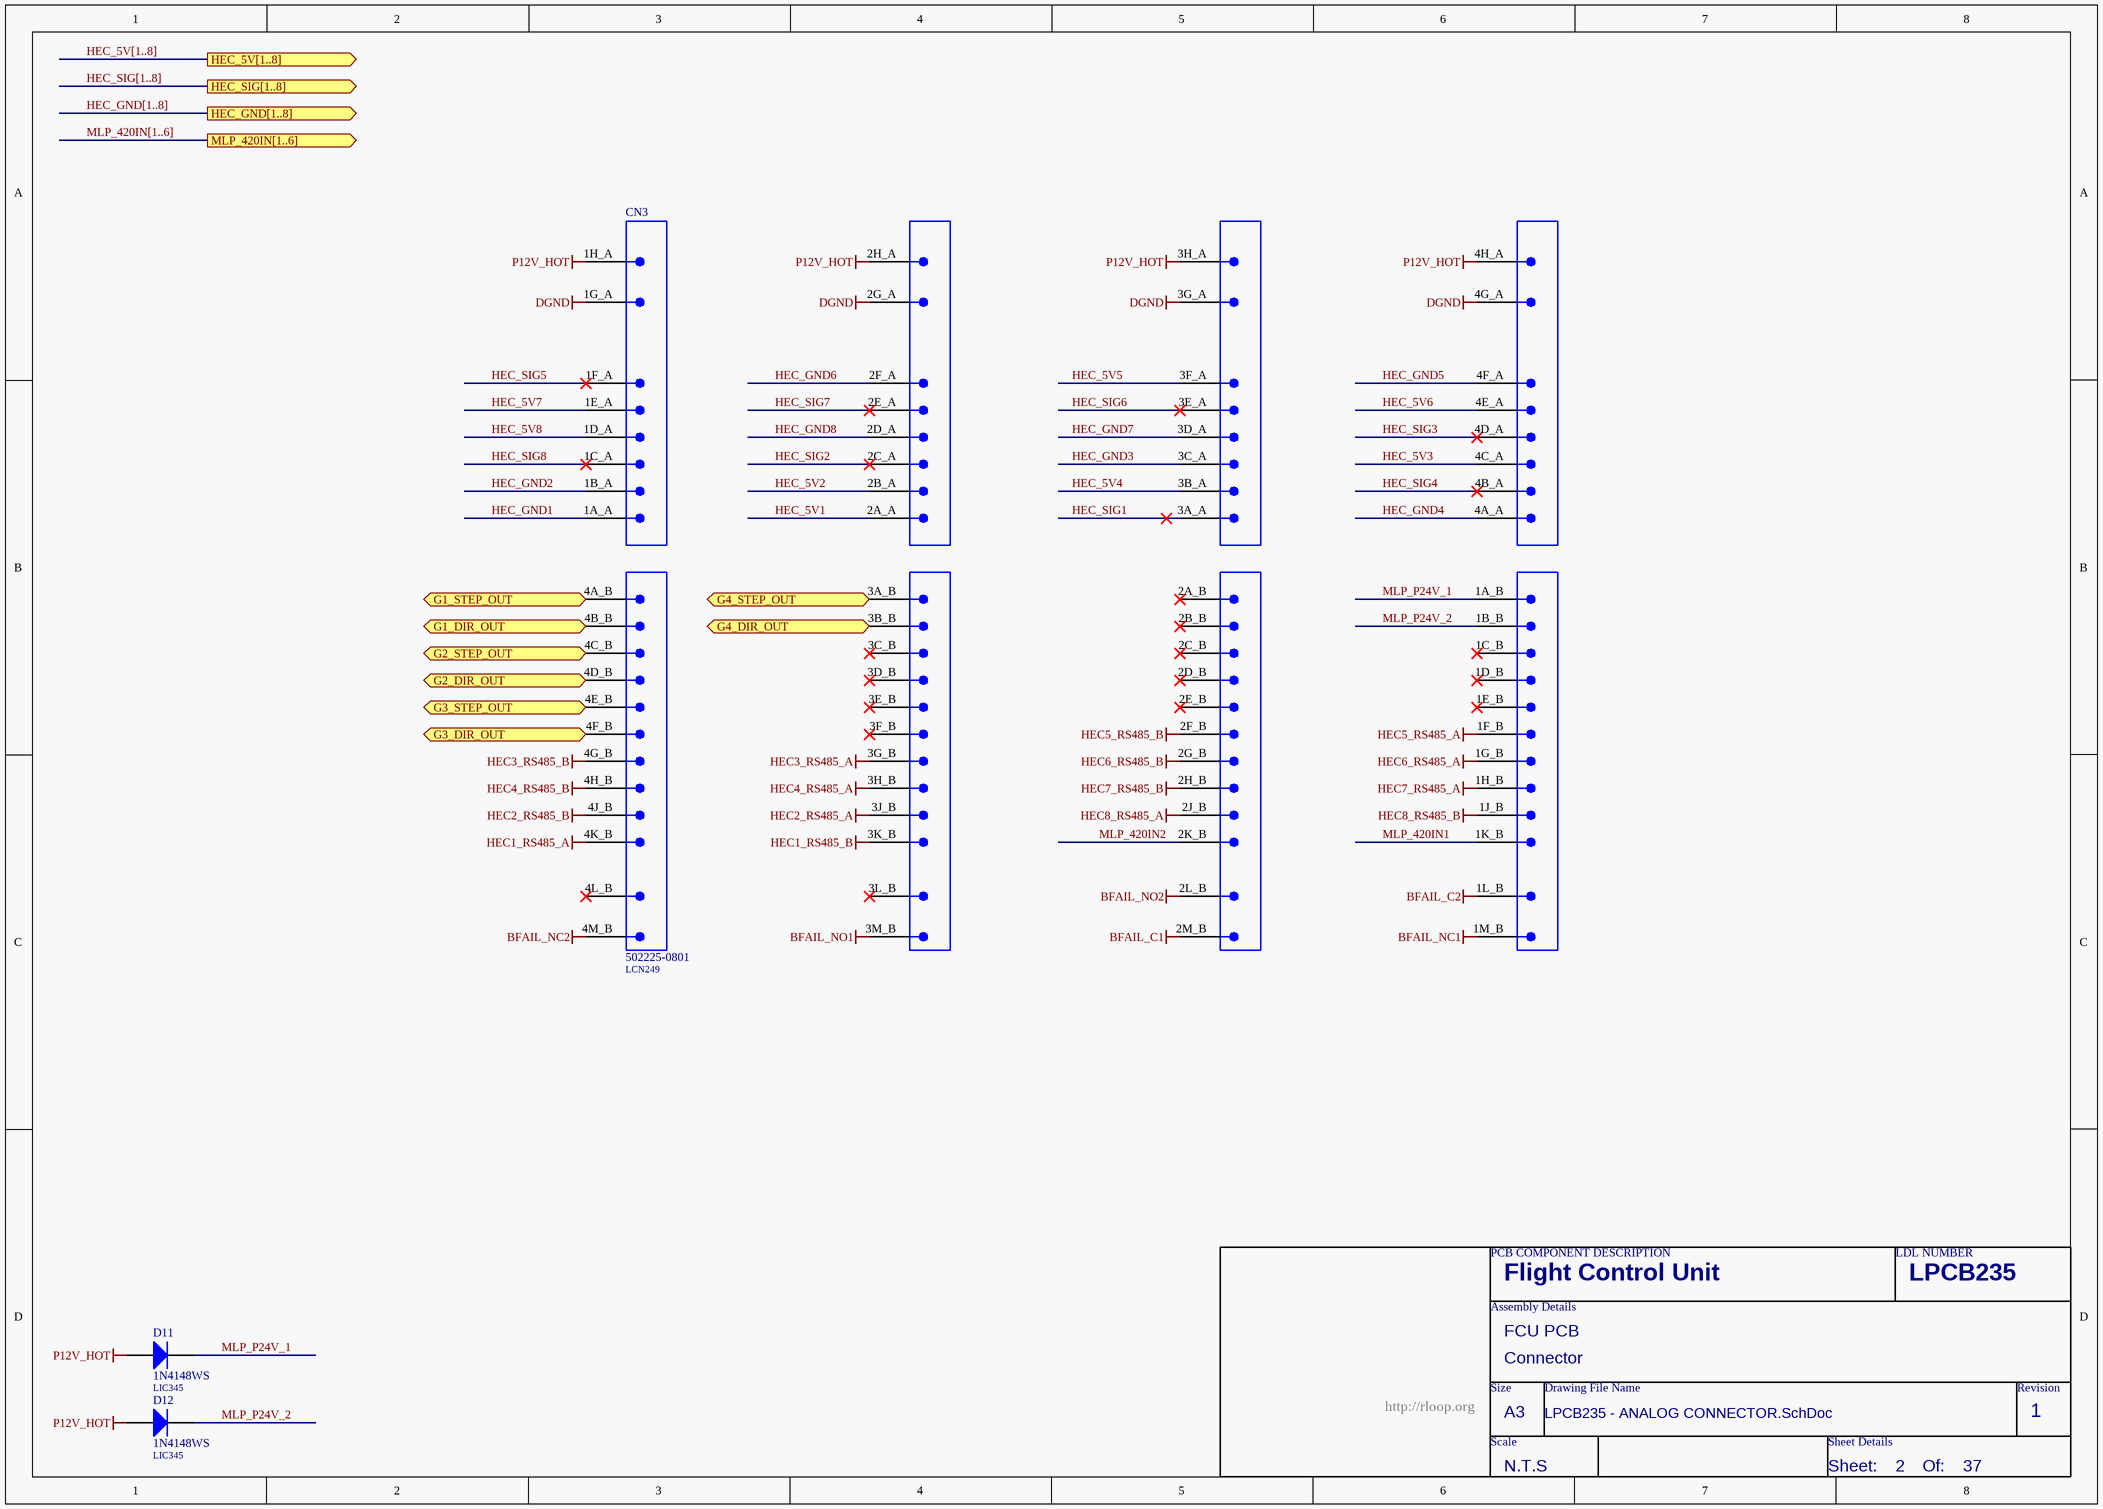
[diagram p26: LPCB235 - ANALOG CONNECTOR.SchDoc]

### Parts
CN3  502225-0801  LDL_NUMBER: LCN249  [502225-0801]
D11  1N4148WS  LDL_NUMBER: LIC345  [LFP001__SOD-323F]
D12  1N4148WS  LDL_NUMBER: LIC345  [LFP001__SOD-323F]

### Ports
G1_DIR_OUT (in), G1_STEP_OUT (in), G2_DIR_OUT (in), G2_STEP_OUT (in), G3_DIR_OUT (in), G3_STEP_OUT (in), G4_DIR_OUT (in), G4_STEP_OUT (in), HEC_5V[1..8] (out), HEC_GND[1..8] (out), HEC_SIG[1..8] (out), MLP_420IN[1..6] (out)

### Nets
BFAIL_C1: CN3.2M_B
BFAIL_C2: CN3.1L_B
BFAIL_NC1: CN3.1M_B
BFAIL_NC2: CN3.4M_B
BFAIL_NO1: CN3.3M_B
BFAIL_NO2: CN3.2L_B
DGND: CN3.1G_A(1G) CN3.2G_A(2G) CN3.3G_A(3G) CN3.4G_A(4G)
HEC1_RS485_A: CN3.4K_B
HEC1_RS485_B: CN3.3K_B
HEC2_RS485_A: CN3.3J_B
HEC2_RS485_B: CN3.4J_B
HEC3_RS485_A: CN3.3G_B
HEC3_RS485_B: CN3.4G_B
HEC4_RS485_A: CN3.3H_B
HEC4_RS485_B: CN3.4H_B
HEC5_RS485_A: CN3.1F_B
HEC5_RS485_B: CN3.2F_B
HEC6_RS485_A: CN3.1G_B
HEC6_RS485_B: CN3.2G_B
HEC7_RS485_A: CN3.1H_B
HEC7_RS485_B: CN3.2H_B
HEC8_RS485_A: CN3.2J_B
HEC8_RS485_B: CN3.1J_B
P12V_HOT: CN3.1H_A(1H) CN3.2H_A(2H) CN3.3H_A(3H) CN3.4H_A(4H) D11.2(A) D12.2(A)
G1_DIR_OUT: CN3.4B_B ; port G1_DIR_OUT
G1_STEP_OUT: CN3.4A_B ; port G1_STEP_OUT
G2_DIR_OUT: CN3.4D_B ; port G2_DIR_OUT
G2_STEP_OUT: CN3.4C_B ; port G2_STEP_OUT
G3_DIR_OUT: CN3.4F_B ; port G3_DIR_OUT
G3_STEP_OUT: CN3.4E_B ; port G3_STEP_OUT
G4_DIR_OUT: CN3.3B_B ; port G4_DIR_OUT
G4_STEP_OUT: CN3.3A_B ; port G4_STEP_OUT
HEC_5V1: CN3.2A_A(2A)
HEC_5V2: CN3.2B_A(2B)
HEC_5V3: CN3.4C_A(4C)
HEC_5V4: CN3.3B_A(3B)
HEC_5V5: CN3.3F_A(3F)
HEC_5V6: CN3.4E_A(4E)
HEC_5V7: CN3.1E_A(1E)
HEC_5V8: CN3.1D_A(1D)
HEC_GND1: CN3.1A_A(1A)
HEC_GND2: CN3.1B_A(1B)
HEC_GND3: CN3.3C_A(3C)
HEC_GND4: CN3.4A_A(4A)
HEC_GND5: CN3.4F_A(4F)
HEC_GND6: CN3.2F_A(2F)
HEC_GND7: CN3.3D_A(3D)
HEC_GND8: CN3.2D_A(2D)
HEC_SIG1: CN3.3A_A(3A)
HEC_SIG2: CN3.2C_A(2C)
HEC_SIG3: CN3.4D_A(4D)
HEC_SIG4: CN3.4B_A(4B)
HEC_SIG5: CN3.1F_A(1F)
HEC_SIG6: CN3.3E_A(3E)
HEC_SIG7: CN3.2E_A(2E)
HEC_SIG8: CN3.1C_A(1C)
MLP_420IN1: CN3.1K_B
MLP_420IN2: CN3.2K_B
MLP_P24V_1: CN3.1A_B D11.1(K)
MLP_P24V_2: CN3.1B_B D12.1(K)

Not connected (* = marked no-connect by the designer): CN3 1C_B* 1D_B* 1E_B* 2A_B* 2B_B* 2C_B* 2D_B* 2E_B* 3C_B* 3D_B* 3E_B* 3F_B* 3L_B* 4L_B*

### Buses and harness runs
bus HEC_5V[1..8] = port HEC_5V[1..8]
bus HEC_GND[1..8] = port HEC_GND[1..8]
bus HEC_SIG[1..8] = port HEC_SIG[1..8]
bus MLP_420IN[1..6] = port MLP_420IN[1..6]

### Notes on the sheet
- PCB COMPONENT DESCRIPTION
- LDL NUMBER
- Assembly Details
- Size
- Drawing File Name
- Revision
- http://rloop.org
- Scale
- A3
- Sheet Details
- N.T.S
- Sheet:
- Of:

### Library data of the parts
CN3 = 502225-0801: Connector, Molex CMC, Automotive Socket, 80 Circuits, 2 Pockets; FMEDA__CHANNEL: COM; FMEDA__OPERATING__CURRENT_MAX: 0; FMEDA__OPERATING__TEMP_MAX: 50; FMEDA__OPERATING__TEMP_MIN: -20; FMEDA__OPERATING__TEMP_TYP: 27; FMEDA__OPERATING__VOLTAGE_MAX: 16; FMEDA__OPERATING__VOLTAGE_TYP: 12; FMEDA__FUNCTION_IN_SYSTEM: *; FMEDA__OPERATING__CURRENT_MIN: 0; FMEDA__OPERATING__CURRENT_TYP: 0; FMEDA__OPERATING__VOLTAGE_MIN: 0
D11 D12 = 1N4148WS: Diode, Small Signal, SMD SOD-323F [LIC345]; FMEDA__FUNCTION_IN_SYSTEM: ACCEL PSU INPUT DIODE; FMEDA__OPERATING__TEMP_MAX: 50; FMEDA__OPERATING__TEMP_MIN: -20; FMEDA__OPERATING__TEMP_TYP: 27; FMEDA__OPERATING__VOLTAGE_MAX: 0; FMEDA__CHANNEL: COM; FMEDA__OPERATING__VOLTAGE_MIN: 0; FMEDA__OPERATING__VOLTAGE_TYP: 0; FMEDA__OPERATING__CURRENT_MAX: 0; FMEDA__OPERATING__CURRENT_MIN: 0; FMEDA__OPERATING__CURRENT_TYP: 0

## Sheet LPCB235 - CONTRAST LASERS.SchDoc
size A3; Address1: Factory 10; Address2: 9-13 Dingley Avenue, Dandeong, VICTORIA 3175, AUSTRALIA; DocumentNumber: 9; Revision: 1; SheetNumber: 9; SheetTotal: 37; Lockie__PCB_SUB_ASSEMBLY: Contrast Lasers; Lockie__PCB_ASSEMBLY: FCU PCB; Lockie__LDL: LPCB235; Lockie__PCB_DESCRIPTION: Flight Control Unit
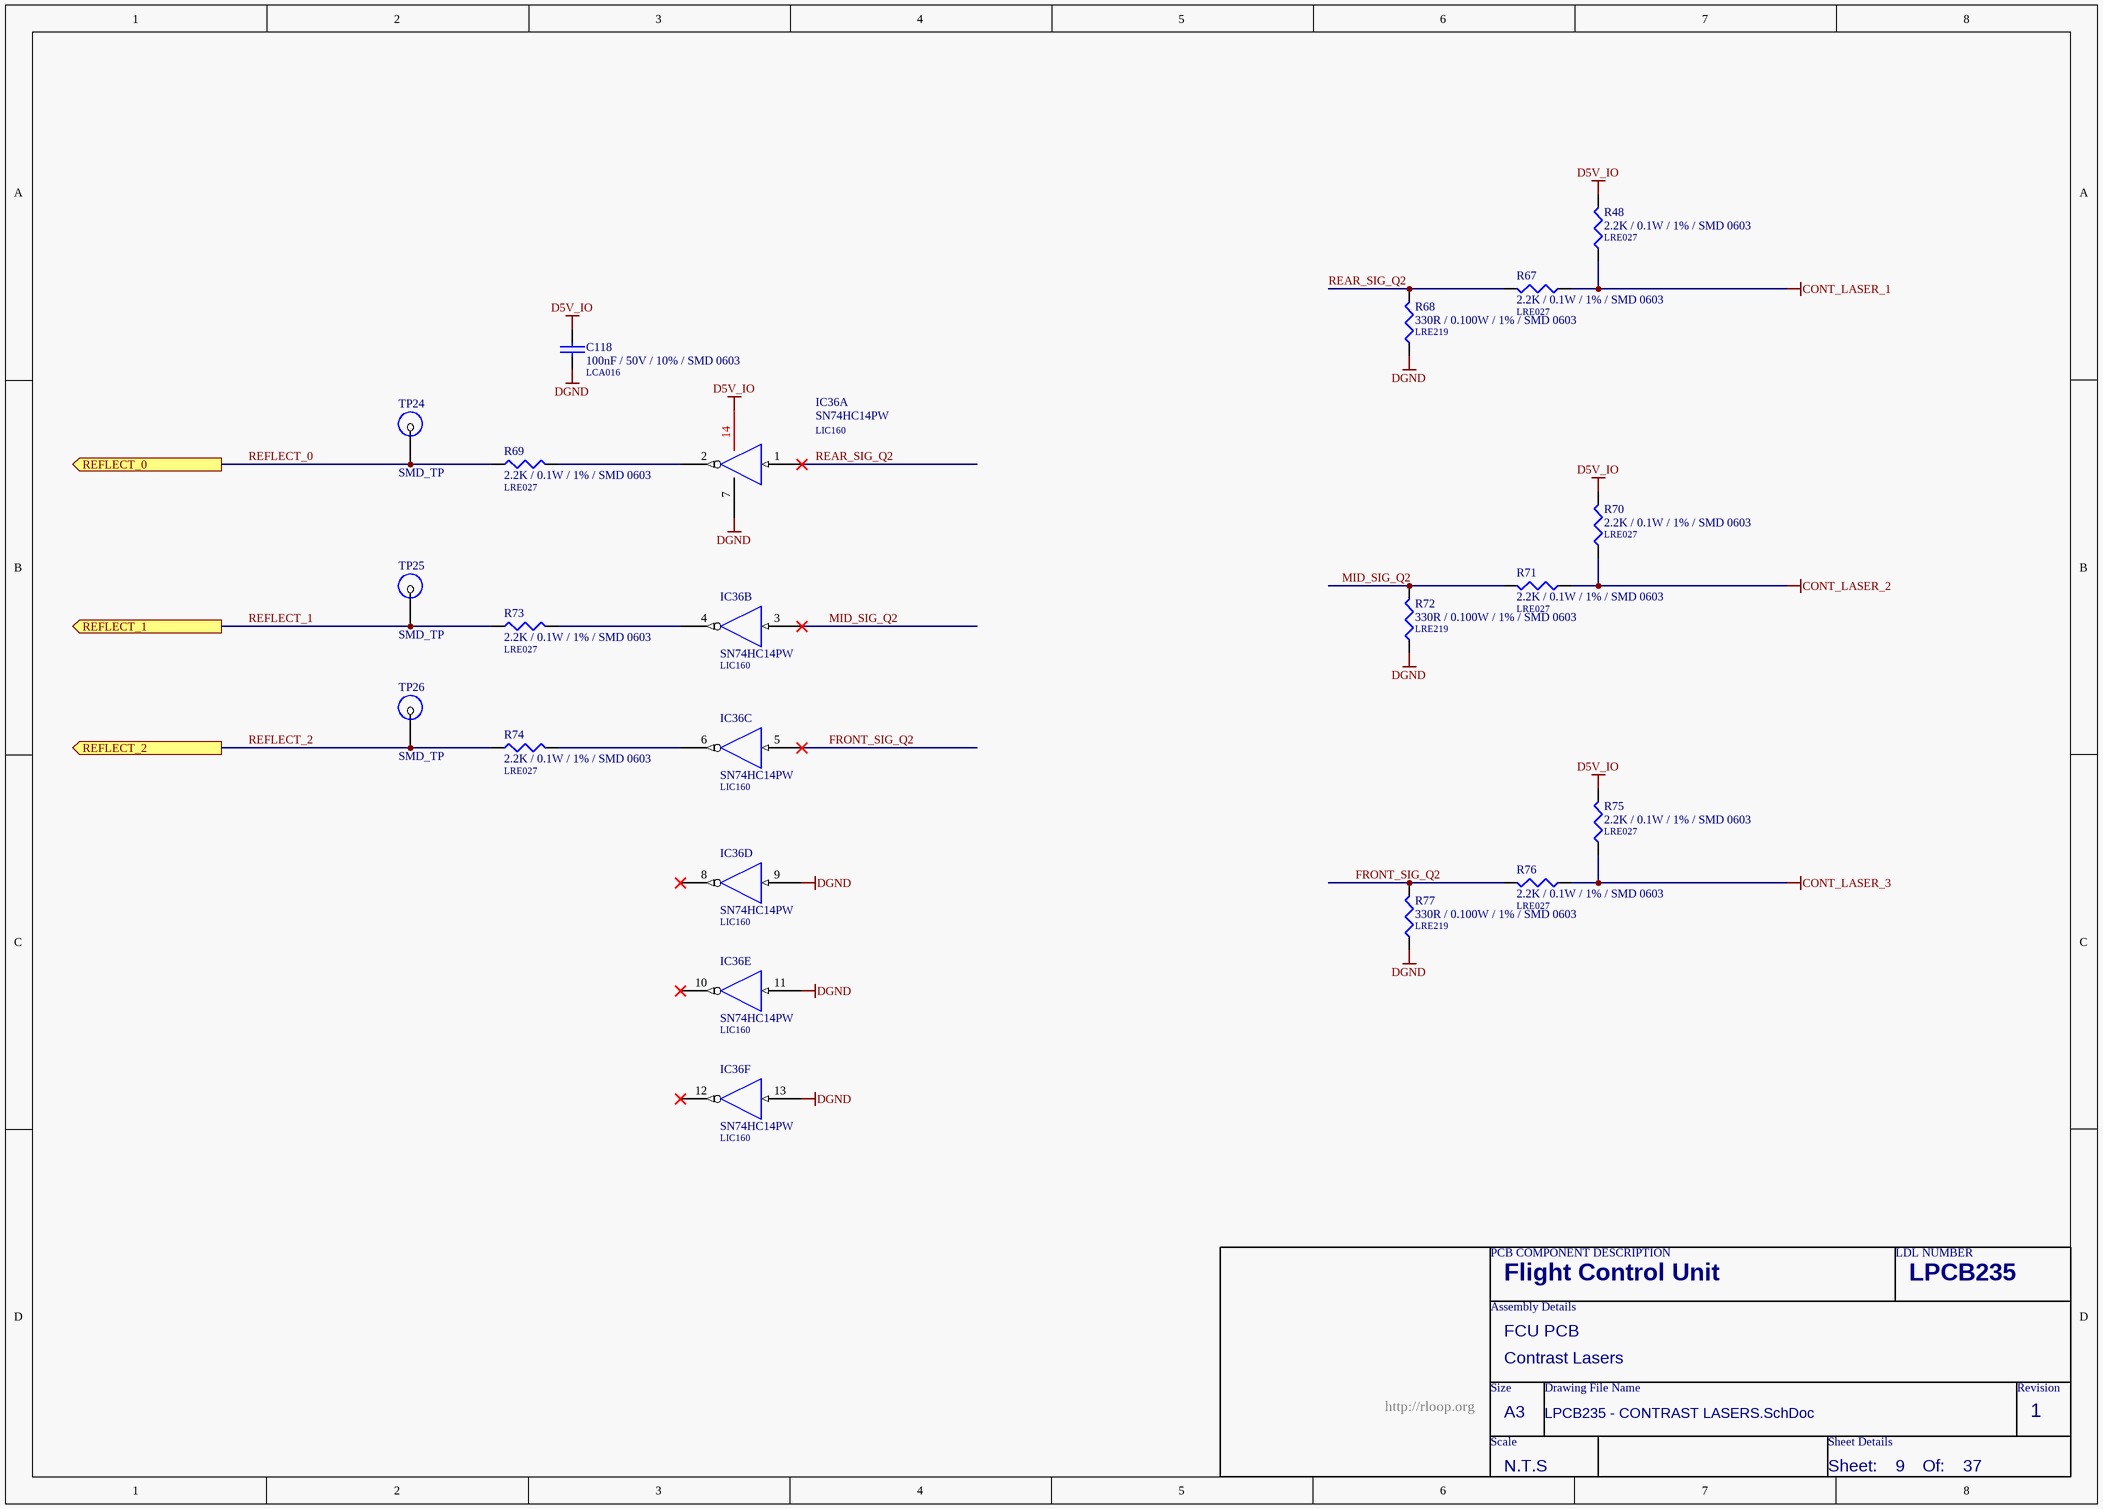
[diagram p27: LPCB235 - CONTRAST LASERS.SchDoc]

### Parts
C118  100nF / 50V / 10% / SMD 0603  LDL_NUMBER: LCA016  [LFP011__CC1608-0603-IPC7351_B]
IC36  SN74HC14PW  LDL_NUMBER: LIC160  [PW014]  (parts A,B,C,D,E,F of 6)
R48  2.2K / 0.1W / 1% / SMD 0603  LDL_NUMBER: LRE027  [LFP020__CR1608-0603-IPC7351_B]
R67  2.2K / 0.1W / 1% / SMD 0603  LDL_NUMBER: LRE027  [LFP020__CR1608-0603-IPC7351_B]
R68  330R / 0.100W / 1% / SMD 0603  LDL_NUMBER: LRE219  [LFP020__CR1608-0603-IPC7351_B]
R69  2.2K / 0.1W / 1% / SMD 0603  LDL_NUMBER: LRE027  [LFP020__CR1608-0603-IPC7351_B]
R70  2.2K / 0.1W / 1% / SMD 0603  LDL_NUMBER: LRE027  [LFP020__CR1608-0603-IPC7351_B]
R71  2.2K / 0.1W / 1% / SMD 0603  LDL_NUMBER: LRE027  [LFP020__CR1608-0603-IPC7351_B]
R72  330R / 0.100W / 1% / SMD 0603  LDL_NUMBER: LRE219  [LFP020__CR1608-0603-IPC7351_B]
R73  2.2K / 0.1W / 1% / SMD 0603  LDL_NUMBER: LRE027  [LFP020__CR1608-0603-IPC7351_B]
R74  2.2K / 0.1W / 1% / SMD 0603  LDL_NUMBER: LRE027  [LFP020__CR1608-0603-IPC7351_B]
R75  2.2K / 0.1W / 1% / SMD 0603  LDL_NUMBER: LRE027  [LFP020__CR1608-0603-IPC7351_B]
R76  2.2K / 0.1W / 1% / SMD 0603  LDL_NUMBER: LRE027  [LFP020__CR1608-0603-IPC7351_B]
R77  330R / 0.100W / 1% / SMD 0603  LDL_NUMBER: LRE219  [LFP020__CR1608-0603-IPC7351_B]
TP24  SMD_TP  [SMD-TP]  (no BOM)
TP25  SMD_TP  [SMD-TP]  (no BOM)
TP26  SMD_TP  [SMD-TP]  (no BOM)

### Ports
REFLECT_0 (out), REFLECT_1 (out), REFLECT_2 (out)

### Nets
CONT_LASER_1: R48.1 R67.1
CONT_LASER_2: R70.1 R71.1
CONT_LASER_3: R75.1 R76.1
D5V_IO: C118.1 IC36.14(VCC) R48.2 R70.2 R75.2
DGND: C118.2 IC36.7(GND) IC36.9(A) IC36.11(A) IC36.13(A) R68.1 R72.1 R77.1
FRONT_SIG_Q2: IC36.5(A) R76.2 R77.2
MID_SIG_Q2: IC36.3(A) R71.2 R72.2
REAR_SIG_Q2: IC36.1(A) R67.2 R68.2
REFLECT_0: R69.1 TP24.1 ; port REFLECT_0
REFLECT_1: R73.1 TP25.1 ; port REFLECT_1
REFLECT_2: R74.1 TP26.1 ; port REFLECT_2
NetIC36_2: IC36.2(Y) R69.2
NetIC36_4: IC36.4(Y) R73.2
NetIC36_6: IC36.6(Y) R74.2

Not connected (* = marked no-connect by the designer): IC36 8(Y)* 10(Y)* 12(Y)*

### Notes on the sheet
- PCB COMPONENT DESCRIPTION
- LDL NUMBER
- Assembly Details
- Size
- Drawing File Name
- Revision
- http://rloop.org
- Scale
- A3
- Sheet Details
- N.T.S
- Sheet:
- Of:

### Library data of the parts
C118 = 100nF / 50V / 10% / SMD 0603: as C113-C117 on sheet LPCB235 - SPI UART - GROUP B1; FMEDA__FUNCTION_IN_SYSTEM: *; FMEDA__OPERATING__VOLTAGE_TYP: 3.3
IC36 = SN74HC14PW: IC, Hex Inveter, Schmitt Trigger, SMD [LIC160]; FMEDA__OPERATING__TEMP_MAX: 50; FMEDA__OPERATING__TEMP_MIN: -20; FMEDA__OPERATING__TEMP_TYP: 27; FMEDA__CHANNEL: COM; Revision: 17-Jul-2002: Re-released for DXP Platform.
R48 R67 R69-R71 R73-R76 = 2.2K / 0.1W / 1% / SMD 0603: Resistor, Ceramic Chip, 2.2K, 0.1W, 1%, SMD 0603 [LRE027]; FMEDA__OPERATING__VOLTAGE_MIN: 0; FMEDA__OPERATING__TEMP_MIN: -20; FMEDA__OPERATING__TEMP_TYP: 27; FMEDA__OPERATING__TEMP_MAX: 50; FMEDA__CHANNEL: COM; VALUE: 2.2K; FMEDA__OPERATING__VOLTAGE_MAX: 0; FMEDA__OPERATING__POWER_MIN: 0; FMEDA__OPERATING__POWER_MAX: 0; FMEDA__FUNCTION_IN_SYSTEM: *; FMEDA__OPERATING__VOLTAGE_TYP: 0
R68 R72 R77 = 330R / 0.100W / 1% / SMD 0603: Resistor, Thick Film, 330R, 0.100W, 75V, 1%, SMD 0603 [LRE219]; VALUE: 330; FMEDA__OPERATING__POWER_MAX: 0.1; FMEDA__OPERATING__POWER_MIN: 0; FMEDA__OPERATING__VOLTAGE_MAX: 75; FMEDA__OPERATING__TEMP_MAX: 155; FMEDA__OPERATING__TEMP_MIN: -55; FMEDA__OPERATING__TEMP_TYP: 27; FMEDA__CHANNEL: COM; FMEDA__OPERATING__VOLTAGE_MIN: 0; FMEDA__OPERATING__VOLTAGE_TYP: 75; FMEDA__FUNCTION_IN_SYSTEM: *
TP24-TP26 = SMD_TP: as TP1 on sheet LPCB235 - DAC; FMEDA__OPERATING__CURRENT_MIN: 0; FMEDA__OPERATING__CURRENT_TYP: 0; FMEDA__OPERATING__VOLTAGE_MIN: 0

## Sheet LPCB235 - PUSHER INTERLOCK.SchDoc
size A3; Address1: Factory 10; Address2: 9-13 Dingley Avenue, Dandeong, VICTORIA 3175, AUSTRALIA; DocumentNumber: 20; Revision: 1; SheetNumber: 20; SheetTotal: 37; Lockie__PCB_SUB_ASSEMBLY: Pusher Interlock; Lockie__PCB_ASSEMBLY: FCU PCB; Lockie__LDL: LPCB235; Lockie__PCB_DESCRIPTION: Flight Control Unit
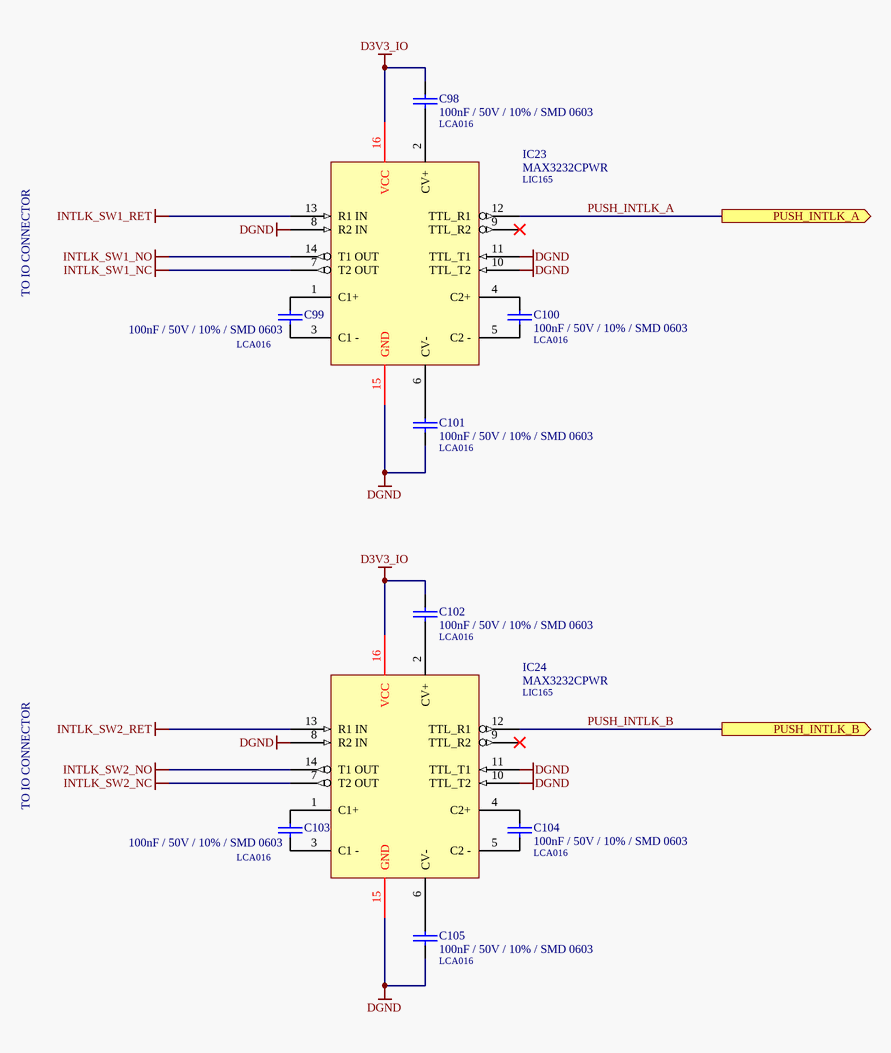
[diagram p28: LPCB235 - PUSHER INTERLOCK.SchDoc]

### Parts
C98  100nF / 50V / 10% / SMD 0603  LDL_NUMBER: LCA016  [LFP011__CC1608-0603-IPC7351_B]
C99  100nF / 50V / 10% / SMD 0603  LDL_NUMBER: LCA016  [LFP011__CC1608-0603-IPC7351_B]
C100  100nF / 50V / 10% / SMD 0603  LDL_NUMBER: LCA016  [LFP011__CC1608-0603-IPC7351_B]
C101  100nF / 50V / 10% / SMD 0603  LDL_NUMBER: LCA016  [LFP011__CC1608-0603-IPC7351_B]
C102  100nF / 50V / 10% / SMD 0603  LDL_NUMBER: LCA016  [LFP011__CC1608-0603-IPC7351_B]
C103  100nF / 50V / 10% / SMD 0603  LDL_NUMBER: LCA016  [LFP011__CC1608-0603-IPC7351_B]
C104  100nF / 50V / 10% / SMD 0603  LDL_NUMBER: LCA016  [LFP011__CC1608-0603-IPC7351_B]
C105  100nF / 50V / 10% / SMD 0603  LDL_NUMBER: LCA016  [LFP011__CC1608-0603-IPC7351_B]
IC23  MAX3232CPWR  LDL_NUMBER: LIC165  [LFP049__TSSOP-16]
IC24  MAX3232CPWR  LDL_NUMBER: LIC165  [LFP049__TSSOP-16]

### Ports
PUSH_INTLK_A (out), PUSH_INTLK_B (out)

### Nets
D3V3_IO: C98.1 C102.1 IC23.16(VCC) IC24.16(VCC)
DGND: C101.2 C105.2 IC23.8(R2_IN) IC23.10(TTL_T2) IC23.11(TTL_T1) IC23.15(GND) IC24.8(R2_IN) IC24.10(TTL_T2) IC24.11(TTL_T1) IC24.15(GND)
INTLK_SW1_NC: IC23.7(T2_OUT)
INTLK_SW1_NO: IC23.14(T1_OUT)
INTLK_SW1_RET: IC23.13(R1_IN)
INTLK_SW2_NC: IC24.7(T2_OUT)
INTLK_SW2_NO: IC24.14(T1_OUT)
INTLK_SW2_RET: IC24.13(R1_IN)
PUSH_INTLK_A: IC23.12(TTL_R1) ; port PUSH_INTLK_A
PUSH_INTLK_B: IC24.12(TTL_R1) ; port PUSH_INTLK_B
NetC98_2: C98.2 IC23.2(CV+)
NetC99_1: C99.1 IC23.1(C1+)
NetC99_2: C99.2 IC23.3(C1_-)
NetC100_1: C100.1 IC23.4(C2+)
NetC100_2: C100.2 IC23.5(C2_-)
NetC101_1: C101.1 IC23.6(CV-)
NetC102_2: C102.2 IC24.2(CV+)
NetC103_1: C103.1 IC24.1(C1+)
NetC103_2: C103.2 IC24.3(C1_-)
NetC104_1: C104.1 IC24.4(C2+)
NetC104_2: C104.2 IC24.5(C2_-)
NetC105_1: C105.1 IC24.6(CV-)

Not connected (* = marked no-connect by the designer): IC23 9(TTL_R2)*; IC24 9(TTL_R2)*

### Notes on the sheet
- TO IO CONNECTOR
- PCB COMPONENT DESCRIPTION
- LDL NUMBER
- Assembly Details
- Size
- Drawing File Name
- Revision
- http://rloop.org
- Scale
- A3
- Sheet Details
- N.T.S
- Sheet:
- Of:

### Library data of the parts
C98-C105 = 100nF / 50V / 10% / SMD 0603: as C113-C117 on sheet LPCB235 - SPI UART - GROUP B1; FMEDA__FUNCTION_IN_SYSTEM: *; FMEDA__OPERATING__VOLTAGE_TYP: 3.3
IC23 IC24 = MAX3232CPWR: as IC35 on sheet LPCB235 - SPI UART - GROUP B1; FMEDA__FUNCTION_IN_SYSTEM: *; FMEDA__OPERATING__VOLTAGE_TYP: 3.3

## Sheet LPCB235 - BRAKE LIMIT SW.SchDoc
size A3; Address1: Unit 4; DocumentNumber: 8; Revision: 2; SheetNumber: 8; SheetTotal: 37; Lockie__PCB_SUB_ASSEMBLY: Brake Limit Switches; Lockie__PCB_ASSEMBLY: FCU PCB; Lockie__LDL: LPCB235; Lockie__PCB_DESCRIPTION: Flight Control Unit
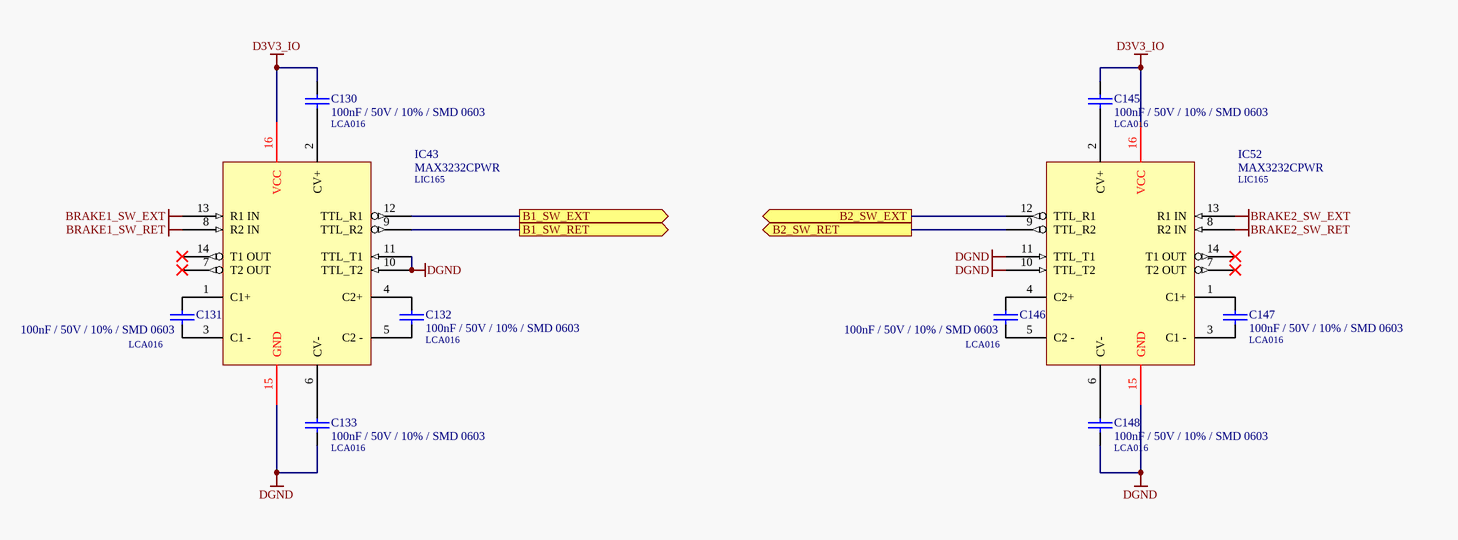
[diagram p29: LPCB235 - BRAKE LIMIT SW.SchDoc]

### Parts
C130  100nF / 50V / 10% / SMD 0603  LDL_NUMBER: LCA016  [LFP011__CC1608-0603-IPC7351_B]
C131  100nF / 50V / 10% / SMD 0603  LDL_NUMBER: LCA016  [LFP011__CC1608-0603-IPC7351_B]
C132  100nF / 50V / 10% / SMD 0603  LDL_NUMBER: LCA016  [LFP011__CC1608-0603-IPC7351_B]
C133  100nF / 50V / 10% / SMD 0603  LDL_NUMBER: LCA016  [LFP011__CC1608-0603-IPC7351_B]
C145  100nF / 50V / 10% / SMD 0603  LDL_NUMBER: LCA016  [LFP011__CC1608-0603-IPC7351_B]
C146  100nF / 50V / 10% / SMD 0603  LDL_NUMBER: LCA016  [LFP011__CC1608-0603-IPC7351_B]
C147  100nF / 50V / 10% / SMD 0603  LDL_NUMBER: LCA016  [LFP011__CC1608-0603-IPC7351_B]
C148  100nF / 50V / 10% / SMD 0603  LDL_NUMBER: LCA016  [LFP011__CC1608-0603-IPC7351_B]
IC43  MAX3232CPWR  LDL_NUMBER: LIC165  [LFP049__TSSOP-16]
IC52  MAX3232CPWR  LDL_NUMBER: LIC165  [LFP049__TSSOP-16]

### Ports
B1_SW_EXT (out), B1_SW_RET (out), B2_SW_EXT (out), B2_SW_RET (out)

### Nets
BRAKE1_SW_EXT: IC43.13(R1_IN)
BRAKE1_SW_RET: IC43.8(R2_IN)
BRAKE2_SW_EXT: IC52.13(R1_IN)
BRAKE2_SW_RET: IC52.8(R2_IN)
D3V3_IO: C130.1 C145.1 IC43.16(VCC) IC52.16(VCC)
DGND: C133.2 C148.2 IC43.10(TTL_T2) IC43.11(TTL_T1) IC43.15(GND) IC52.10(TTL_T2) IC52.11(TTL_T1) IC52.15(GND)
B1_SW_EXT: IC43.12(TTL_R1) ; port B1_SW_EXT
B1_SW_RET: IC43.9(TTL_R2) ; port B1_SW_RET
B2_SW_EXT: IC52.12(TTL_R1) ; port B2_SW_EXT
B2_SW_RET: IC52.9(TTL_R2) ; port B2_SW_RET
NetC130_2: C130.2 IC43.2(CV+)
NetC131_1: C131.1 IC43.1(C1+)
NetC131_2: C131.2 IC43.3(C1_-)
NetC132_1: C132.1 IC43.4(C2+)
NetC132_2: C132.2 IC43.5(C2_-)
NetC133_1: C133.1 IC43.6(CV-)
NetC145_2: C145.2 IC52.2(CV+)
NetC146_1: C146.1 IC52.4(C2+)
NetC146_2: C146.2 IC52.5(C2_-)
NetC147_1: C147.1 IC52.1(C1+)
NetC147_2: C147.2 IC52.3(C1_-)
NetC148_1: C148.1 IC52.6(CV-)

Not connected (* = marked no-connect by the designer): IC43 7(T2_OUT)* 14(T1_OUT)*; IC52 7(T2_OUT)* 14(T1_OUT)*

### Notes on the sheet
- PCB COMPONENT DESCRIPTION
- LDL NUMBER
- Assembly Details
- Size
- Drawing File Name
- Revision
- http://rloop.org
- Scale
- A3
- Sheet Details
- N.T.S
- Sheet:
- Of:

### Library data of the parts
C130-C133 C145-C148 = 100nF / 50V / 10% / SMD 0603: as C113-C117 on sheet LPCB235 - SPI UART - GROUP B1; FMEDA__FUNCTION_IN_SYSTEM: *; FMEDA__OPERATING__VOLTAGE_TYP: 3.3
IC43 = MAX3232CPWR: as IC35 on sheet LPCB235 - SPI UART - GROUP B1; FMEDA__FUNCTION_IN_SYSTEM: *; FMEDA__OPERATING__VOLTAGE_TYP: 3.3
IC52 = MAX3232CPWR: IC, RS232 Line Driver, 3.3V, SMD TSSOP16; FMEDA__OPERATING__TEMP_MAX: 50; FMEDA__OPERATING__TEMP_MIN: -20; FMEDA__OPERATING__TEMP_TYP: 27; FMEDA__CHANNEL: COM; FMEDA__OPERATING__VOLTAGE_MAX: 3.3; FMEDA__OPERATING__VOLTAGE_MIN: 0; FMEDA__FUNCTION_IN_SYSTEM: *; FMEDA__OPERATING__VOLTAGE_TYP: 3.3

## Sheet LPCB235 - AUX POWER.SchDoc
size A3; Address1: Factory 10; Address2: 9-13 Dingley Avenue, Dandeong, VICTORIA 3175, AUSTRALIA; DocumentNumber: 6; Revision: 1; SheetNumber: 6; SheetTotal: 37; Lockie__PCB_SUB_ASSEMBLY: Power Supplies; Lockie__PCB_ASSEMBLY: FCU PCB; Lockie__LDL: LPCB235; Lockie__PCB_DESCRIPTION: Flight Control Unit
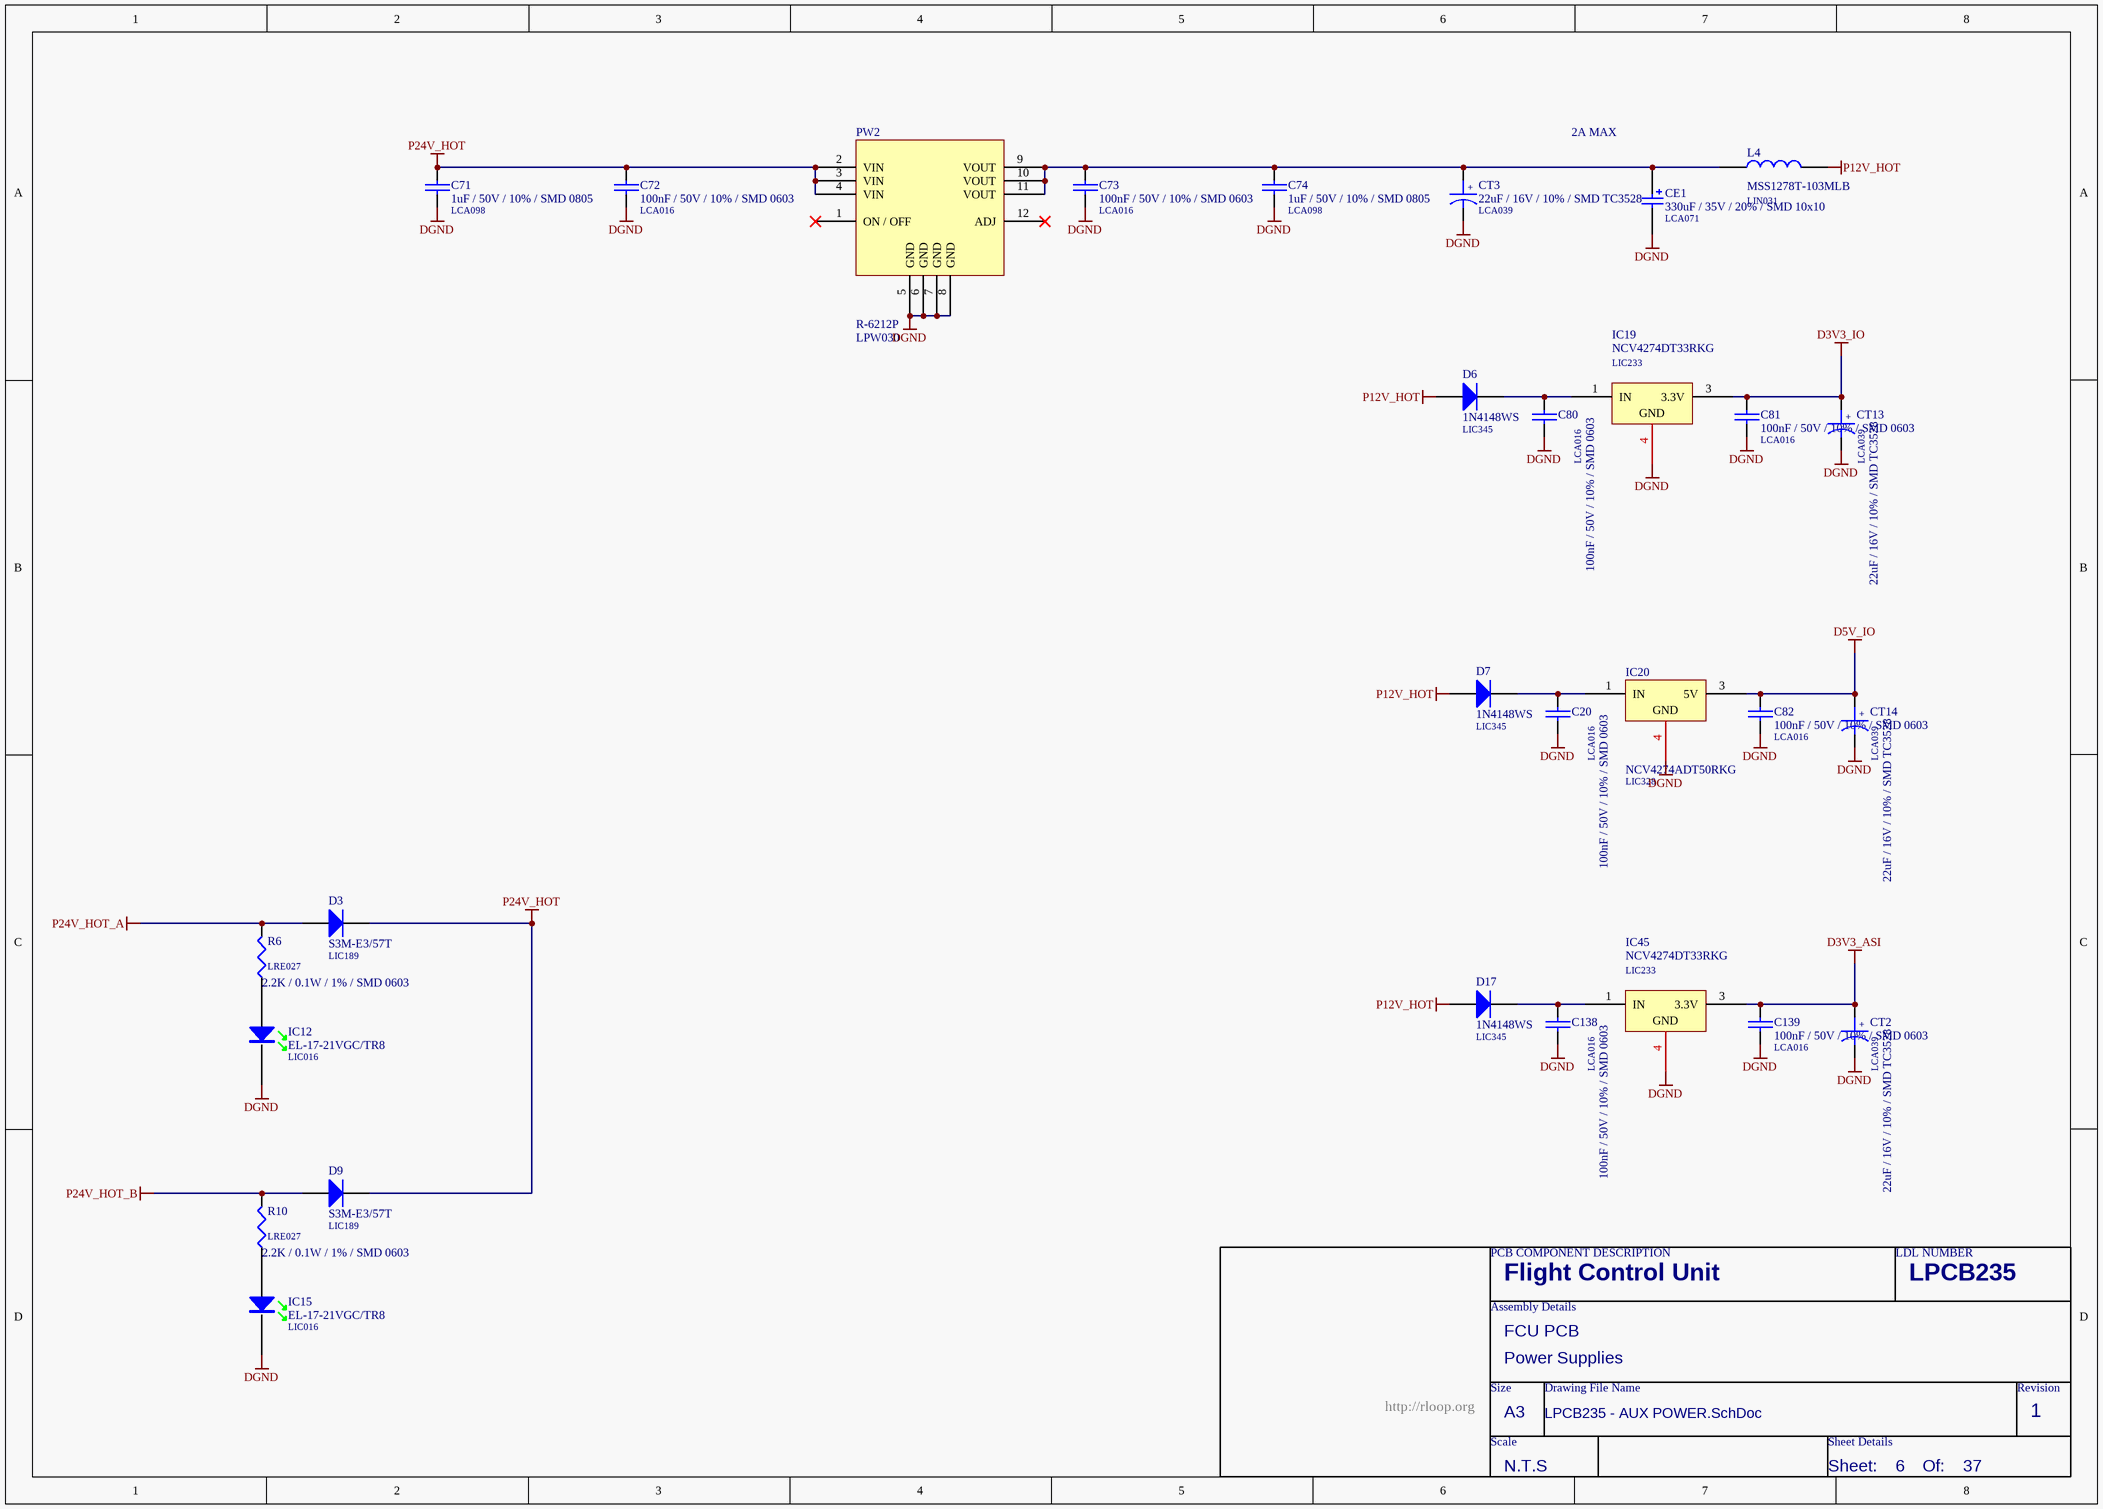
[diagram p30: LPCB235 - AUX POWER.SchDoc]

### Parts
C20  100nF / 50V / 10% / SMD 0603  LDL_NUMBER: LCA016  [LFP011__CC1608-0603-IPC7351_B]
C71  1uF / 50V / 10% / SMD 0805  LDL_NUMBER: LCA098  [LFP010__CC2012-0805-IPC7351_B]
C72  100nF / 50V / 10% / SMD 0603  LDL_NUMBER: LCA016  [LFP011__CC1608-0603-IPC7351_B]
C73  100nF / 50V / 10% / SMD 0603  LDL_NUMBER: LCA016  [LFP011__CC1608-0603-IPC7351_B]
C74  1uF / 50V / 10% / SMD 0805  LDL_NUMBER: LCA098  [LFP010__CC2012-0805-IPC7351_B]
C80  100nF / 50V / 10% / SMD 0603  LDL_NUMBER: LCA016  [LFP011__CC1608-0603-IPC7351_B]
C81  100nF / 50V / 10% / SMD 0603  LDL_NUMBER: LCA016  [LFP011__CC1608-0603-IPC7351_B]
C82  100nF / 50V / 10% / SMD 0603  LDL_NUMBER: LCA016  [LFP011__CC1608-0603-IPC7351_B]
C138  100nF / 50V / 10% / SMD 0603  LDL_NUMBER: LCA016  [LFP011__CC1608-0603-IPC7351_B]
C139  100nF / 50V / 10% / SMD 0603  LDL_NUMBER: LCA016  [LFP011__CC1608-0603-IPC7351_B]
CE1  330uF / 35V / 20% / SMD 10x10  LDL_NUMBER: LCA071  [LFP041__NICHICON_WT_10X10]
CT2  22uF / 16V / 10% / SMD TC3528  LDL_NUMBER: LCA039  [LFP018__TC3528]
CT3  22uF / 16V / 10% / SMD TC3528  LDL_NUMBER: LCA039  [LFP018__TC3528]
CT13  22uF / 16V / 10% / SMD TC3528  LDL_NUMBER: LCA039  [LFP018__TC3528]
CT14  22uF / 16V / 10% / SMD TC3528  LDL_NUMBER: LCA039  [LFP018__TC3528]
D3  S3M-E3/57T  LDL_NUMBER: LIC189  [LFP040__DO-214AB]
D6  1N4148WS  LDL_NUMBER: LIC345  [LFP001__SOD-323F]
D7  1N4148WS  LDL_NUMBER: LIC345  [LFP001__SOD-323F]
D9  S3M-E3/57T  LDL_NUMBER: LIC189  [LFP040__DO-214AB]
D17  1N4148WS  LDL_NUMBER: LIC345  [LFP001__SOD-323F]
IC12  EL-17-21VGC/TR8  LDL_NUMBER: LIC016  [CR2012-0805-LED]
IC15  EL-17-21VGC/TR8  LDL_NUMBER: LIC016  [CR2012-0805-LED]
IC19  NCV4274DT33RKG  LDL_NUMBER: LIC233  [LFP019__369A-13]
IC20  NCV4274ADT50RKG  LDL_NUMBER: LIC328  [LFP019__369A-13]
IC45  NCV4274DT33RKG  LDL_NUMBER: LIC233  [LFP019__369A-13]
L4  MSS1278T-103MLB  LDL_NUMBER: LIN031  [LFP037__MSS1278T]
PW2  R-6212P  LDL_NUMBER: LPW030  [R-625.0P]
R6  2.2K / 0.1W / 1% / SMD 0603  LDL_NUMBER: LRE027  [LFP020__CR1608-0603-IPC7351_B]
R10  2.2K / 0.1W / 1% / SMD 0603  LDL_NUMBER: LRE027  [LFP020__CR1608-0603-IPC7351_B]

### Nets
D3V3_ASI: C139.1 CT2.1 IC45.3(3.3V)
D3V3_IO: C81.1 CT13.1 IC19.3(3.3V)
D5V_IO: C82.1 CT14.1 IC20.3(5V)
DGND: C20.2 C71.2 C72.2 C73.2 C74.2 C80.2 C81.2 C82.2 C138.2 C139.2 CE1.2 CT2.2 CT3.2 CT13.2 CT14.2 IC12.K IC15.K IC19.4(GND) IC20.4(ADJ) IC45.4(GND) PW2.5(GND) PW2.6(GND) PW2.7(GND) PW2.8(GND)
P12V_HOT: D6.2(A) D7.2(A) D17.2(A) L4.2
P24V_HOT: C71.1 C72.1 D3.1(K) D9.1(K) PW2.2(VIN) PW2.3(VIN) PW2.4(VIN)
P24V_HOT_A: D3.2(A) R6.2
P24V_HOT_B: D9.2(A) R10.2
NetC20_1: C20.1 D7.1(K) IC20.1(IN)
NetC73_1: C73.1 C74.1 CE1.1 CT3.1 L4.1 PW2.9(VOUT) PW2.10(VOUT) PW2.11(VOUT)
NetC80_1: C80.1 D6.1(K) IC19.1(IN)
NetC138_1: C138.1 D17.1(K) IC45.1(IN)
NetIC12_A: IC12.A R6.1
NetIC15_A: IC15.A R10.1

Not connected (* = marked no-connect by the designer): PW2 1(ON_/_OFF)* 12(ADJ)*

### Notes on the sheet
- 2A MAX
- PCB COMPONENT DESCRIPTION
- LDL NUMBER
- Assembly Details
- Size
- Drawing File Name
- Revision
- http://rloop.org
- Scale
- A3
- Sheet Details
- N.T.S
- Sheet:
- Of:
- (in symbol 22uF / 16V / 10% / SMD TC3528) +
- (in symbol NCV4274ADT50RKG) GND

### Library data of the parts
C20 C72 C73 C80-C82 C138 C139 = 100nF / 50V / 10% / SMD 0603: as C113-C117 on sheet LPCB235 - SPI UART - GROUP B1; FMEDA__FUNCTION_IN_SYSTEM: *; FMEDA__OPERATING__VOLTAGE_TYP: 3.3
C71 C74 = 1uF / 50V / 10% / SMD 0805: Capacitor, Ceramic Chip, 1uF, 50V, SMD 0805 [LCA098]; Value: 1u; FMEDA__OPERATING__VOLTAGE_MAX: 3.3; FMEDA__OPERATING__VOLTAGE_MIN: 0; FMEDA__OPERATING__TEMP_MAX: 50; FMEDA__OPERATING__TEMP_MIN: -20; FMEDA__OPERATING__TEMP_TYP: 27; FMEDA__CHANNEL: COM; FMEDA__OPERATING__VOLTAGE_TYP: 3.3; FMEDA__FUNCTION_IN_SYSTEM: *
CE1 = 330uF / 35V / 20% / SMD 10x10: Capacitor, Aluminum Electrolytic, 330uF, 35V, 20%, SMD (10mm x 10mm) [LCA071]; FMEDA__OPERATING__TEMP_MAX: 50; FMEDA__OPERATING__TEMP_MIN: -20; FMEDA__OPERATING__TEMP_TYP: 27; FMEDA__OPERATING__VOLTAGE_MAX: 0; Value: 330u; FMEDA__CHANNEL: COM; FMEDA__OPERATING__VOLTAGE_MIN: 0; FMEDA__OPERATING__VOLTAGE_TYP: 0; FMEDA__FUNCTION_IN_SYSTEM: *
CT2 CT3 CT13 CT14 = 22uF / 16V / 10% / SMD TC3528: Capacitor, Tantalum, 22uF, 16V, 10%, SMD TC3528 (BCASE) [LCA039]; Value: 22u; FMEDA__OPERATING__VOLTAGE_MAX: 3.3; FMEDA__OPERATING__VOLTAGE_MIN: 0; FMEDA__OPERATING__TEMP_MAX: 50; FMEDA__OPERATING__TEMP_MIN: -20; FMEDA__OPERATING__TEMP_TYP: 27; FMEDA__CHANNEL: COM; FMEDA__OPERATING__VOLTAGE_TYP: 3.3; FMEDA__FUNCTION_IN_SYSTEM: *
D3 D9 = S3M-E3/57T: Diode, General Purpose Rectifier, 3A, 200V, SMD DO-214AB [LIC189]; FMEDA__OPERATING__CURRENT_MAX: 0; FMEDA__OPERATING__TEMP_MAX: 50; FMEDA__OPERATING__TEMP_MIN: -20; FMEDA__OPERATING__TEMP_TYP: 27; FMEDA__CHANNEL: COM; FMEDA__OPERATING__CURRENT_MIN: 0; FMEDA__OPERATING__CURRENT_TYP: 0; FMEDA__OPERATING__VOLTAGE_MAX: 0; FMEDA__OPERATING__VOLTAGE_MIN: 0; FMEDA__OPERATING__VOLTAGE_TYP: 0; FMEDA__FUNCTION_IN_SYSTEM: *
D6 D7 D17 = 1N4148WS: as D11 on sheet LPCB235 - ANALOG CONNECTOR; FMEDA__OPERATING__VOLTAGE_MIN: 0; FMEDA__OPERATING__VOLTAGE_TYP: 0; FMEDA__OPERATING__CURRENT_MAX: 0; FMEDA__OPERATING__CURRENT_MIN: 0; FMEDA__OPERATING__CURRENT_TYP: 0
IC12 IC15 = EL-17-21VGC/TR8: LED, SMD, 0805 Green [LIC016]; FMEDA__OPERATING__TEMP_MAX: 50; FMEDA__OPERATING__TEMP_MIN: -20; FMEDA__OPERATING__TEMP_TYP: 27; FMEDA__CHANNEL: COM; FMEDA__FUNCTION_IN_SYSTEM: *
IC19 IC45 = NCV4274DT33RKG: IC, Voltage Regulator, 400mA, 3.3V LDO, SMD DPAK [LIC233]; FMEDA__OPERATING__OUTPUT_CURRENT_MIN: 0; FMEDA__OPERATING__TEMP_MAX: 50; FMEDA__OPERATING__TEMP_MIN: -20; FMEDA__OPERATING__TEMP_TYP: 27; VALUE: 0; Note: Obey Thermal Design Rules; FMEDA__CHANNEL: COM; FMEDA__OPERATING__OUTPUT_CURRENT_TYP: 0; FMEDA__OPERATING__VOLTAGE_MAX: 0; FMEDA__OPERATING__VOLTAGE_MIN: 0; FMEDA__OPERATING__VOLTAGE_TYP: 0; FMEDA__FUNCTION_IN_SYSTEM: *
IC20 = NCV4274ADT50RKG: IC, Voltage Regulator, 400mA, 5V LDO, SMD DPAK [LIC328]; FMEDA__OPERATING__OUTPUT_CURRENT_MIN: 0; FMEDA__OPERATING__TEMP_MAX: 50; FMEDA__OPERATING__TEMP_MIN: -20; FMEDA__OPERATING__TEMP_TYP: 27; VALUE: 0; Note: Obey Thermal Design Rules; FMEDA__CHANNEL: COM; FMEDA__OPERATING__OUTPUT_CURRENT_TYP: 0; FMEDA__OPERATING__VOLTAGE_MAX: 0; FMEDA__OPERATING__VOLTAGE_MIN: 0; FMEDA__OPERATING__VOLTAGE_TYP: 0; FMEDA__FUNCTION_IN_SYSTEM: *
L4 = MSS1278T-103MLB: Inductor, 10uH, 20%, 5.7A, SMD [LIN031]; FMEDA__OPERATING__TEMP_MAX: 50; FMEDA__OPERATING__TEMP_MIN: -20; FMEDA__OPERATING__TEMP_TYP: 27; Value: 10u; FMEDA__CHANNEL: COM; Revision: 1; FMEDA__FUNCTION_IN_SYSTEM: *
PW2 = R-6212P: Non Isolated DC/DC Module
R6 R10 = 2.2K / 0.1W / 1% / SMD 0603: as R48 on sheet LPCB235 - CONTRAST LASERS; VALUE: 2.2K; FMEDA__OPERATING__VOLTAGE_MAX: 0; FMEDA__OPERATING__POWER_MIN: 0; FMEDA__OPERATING__POWER_MAX: 0; FMEDA__FUNCTION_IN_SYSTEM: *; FMEDA__OPERATING__VOLTAGE_TYP: 0

## Sheet LPCB235 - G210 IF AND MUX.SchDoc
size A3; Address1: Factory 10; Address2: 9-13 Dingley Avenue, Dandeong, VICTORIA 3175, AUSTRALIA; DocumentNumber: 11; Revision: 1; SheetNumber: 11; SheetTotal: 37; Lockie__PCB_SUB_ASSEMBLY: G210X Interface; Lockie__PCB_ASSEMBLY: FCU PCB; Lockie__LDL: LPCB235; Lockie__PCB_DESCRIPTION: Flight Control Unit
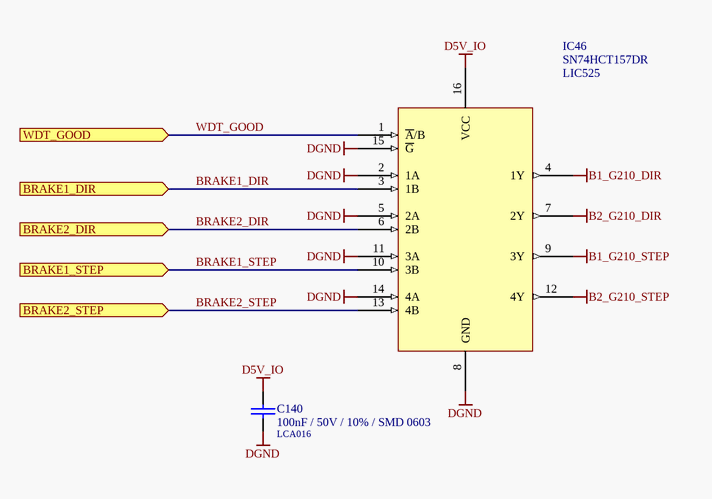
[diagram p31: LPCB235 - G210 IF AND MUX.SchDoc]

### Parts
C140  100nF / 50V / 10% / SMD 0603  LDL_NUMBER: LCA016  [LFP011__CC1608-0603-IPC7351_B]
IC46  SN74HCT157DR  LDL_NUMBER: LIC525  [LFP079__SOP16]

### Ports
BRAKE1_DIR (in), BRAKE1_STEP (in), BRAKE2_DIR (in), BRAKE2_STEP (in), WDT_GOOD (in)

### Nets
B1_G210_DIR: IC46.4(1Y)
B1_G210_STEP: IC46.9(3Y)
B2_G210_DIR: IC46.7(2Y)
B2_G210_STEP: IC46.12(4Y)
D5V_IO: C140.1 IC46.16(VCC)
DGND: C140.2 IC46.2(1A) IC46.5(2A) IC46.8(GND) IC46.11(3A) IC46.14(4A) IC46.15(~{G})
BRAKE1_DIR: IC46.3(1B) ; port BRAKE1_DIR
BRAKE1_STEP: IC46.10(3B) ; port BRAKE1_STEP
BRAKE2_DIR: IC46.6(2B) ; port BRAKE2_DIR
BRAKE2_STEP: IC46.13(4B) ; port BRAKE2_STEP
WDT_GOOD: IC46.1(~{A}/B) ; port WDT_GOOD

### Notes on the sheet
- PCB COMPONENT DESCRIPTION
- LDL NUMBER
- Assembly Details
- Size
- Drawing File Name
- Revision
- http://rloop.org
- Scale
- A3
- Sheet Details
- N.T.S
- Sheet:
- Of:

### Library data of the parts
C140 = 100nF / 50V / 10% / SMD 0603: as C113-C117 on sheet LPCB235 - SPI UART - GROUP B1; FMEDA__FUNCTION_IN_SYSTEM: *; FMEDA__OPERATING__VOLTAGE_TYP: 3.3
IC46 = SN74HCT157DR: IC, Multiplexer Select 2-1 [LIC525]; FMEDA__CHANNEL: COM; FMEDA__FUNCTION_IN_SYSTEM: *

## Sheet LPCB235 - MLP IF.SchDoc
size A3; Address1: Factory 10; Address2: 9-13 Dingley Avenue, Dandeong, VICTORIA 3175, AUSTRALIA; DocumentNumber: 17; Revision: 1; SheetNumber: 17; SheetTotal: 37; Lockie__PCB_SUB_ASSEMBLY: MLP Interface; Lockie__PCB_ASSEMBLY: FCU PCB; Lockie__LDL: LPCB235; Lockie__PCB_DESCRIPTION: Flight Control Unit
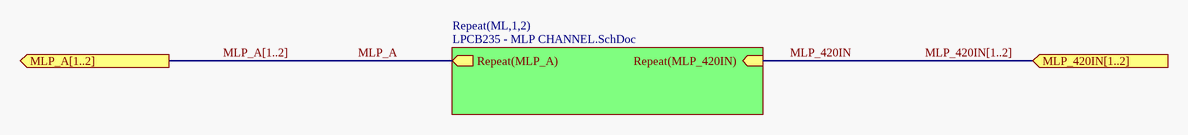
[diagram p32: LPCB235 - MLP IF.SchDoc]

### Sub-sheets
Repeat(ML,1,2) = LPCB235 - MLP CHANNEL.SchDoc: Repeat(MLP_A) (out), Repeat(MLP_420IN) (in)

### Ports
MLP_420IN[1..2] (in), MLP_A[1..2] (out)

### Buses and harness runs
bus MLP_420IN[1..2] = port MLP_420IN[1..2]
bus MLP_A[1..2] = port MLP_A[1..2]

### Notes on the sheet
- PCB COMPONENT DESCRIPTION
- LDL NUMBER
- Assembly Details
- Size
- Drawing File Name
- Revision
- http://rloop.org
- Scale
- A3
- Sheet Details
- N.T.S
- Sheet:
- Of:

## Sheet LPCB235 - MLP CHANNEL.SchDoc
size A3; Address1: Factory 10; Address2: 9-13 Dingley Avenue, Dandeong, VICTORIA 3175, AUSTRALIA; DocumentNumber: 18; Revision: 1; SheetNumber: 18; SheetTotal: 37; Lockie__PCB_SUB_ASSEMBLY: MLP Channel; Lockie__PCB_ASSEMBLY: FCU PCB; Lockie__LDL: LPCB235; Lockie__PCB_DESCRIPTION: Flight Control Unit
Used 2 times, as channels U_LPCB235 - MLP IF/ML1, U_LPCB235 - MLP IF/ML2. Parts and nets are listed once, with the designators drawn on the sheet.
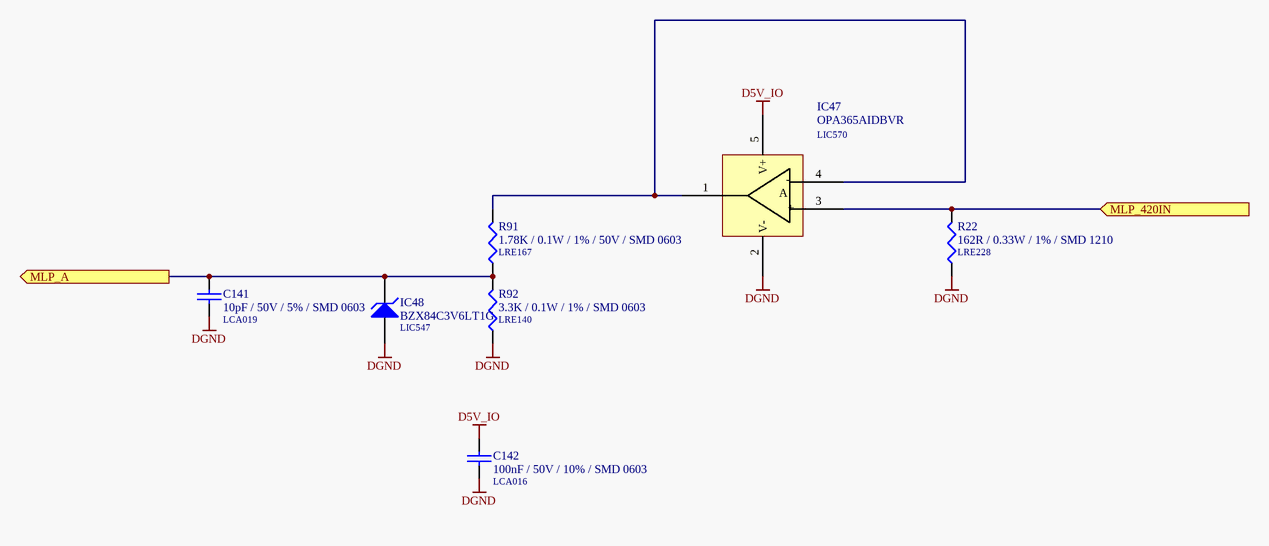
[diagram p33: LPCB235 - MLP CHANNEL.SchDoc]

### Parts
C141  10pF / 50V / 5% / SMD 0603  LDL_NUMBER: LCA019  [LFP011__CC1608-0603-IPC7351_B]
C142  100nF / 50V / 10% / SMD 0603  LDL_NUMBER: LCA016  [LFP011__CC1608-0603-IPC7351_B]
IC47  OPA365AIDBVR  LDL_NUMBER: LIC570  [LFP114__R-PDSO-G5]
IC48  BZX84C3V6LT1G  LDL_NUMBER: LIC547  [LFP021__SOT23]
R22  162R / 0.33W / 1% / SMD 1210  LDL_NUMBER: LRE228  [LFP028__CR3225-1210]
R91  1.78K / 0.1W / 1% / 50V / SMD 0603  LDL_NUMBER: LRE167  [LFP020__CR1608-0603-IPC7351_B]
R92  3.3K / 0.1W / 1% / SMD 0603  LDL_NUMBER: LRE140  [LFP020__CR1608-0603-IPC7351_B]

### Ports
MLP_420IN (in), MLP_A (out)

### Nets
D5V_IO: C142.1 IC47.5(V+)
DGND: C141.2 C142.2 IC47.2(V-) IC48.1(A) R22.1 R92.1
MLP_420IN: IC47.3(+IN_A) R22.2 ; port MLP_420IN
MLP_A: C141.1 IC48.3(K) R91.1 R92.2 ; port MLP_A
NetIC47_1: IC47.1(OUT_A) IC47.4(-IN_A) R91.2

### Channels
U_LPCB235 - MLP IF/ML1: designators end in _ML1; ports MLP_420IN=MLP_420IN1 MLP_A=MLP_A1
U_LPCB235 - MLP IF/ML2: designators end in _ML2; ports MLP_420IN=MLP_420IN2 MLP_A=MLP_A2

### Notes on the sheet
- PCB COMPONENT DESCRIPTION
- LDL NUMBER
- Assembly Details
- Size
- Drawing File Name
- Revision
- http://rloop.org
- Scale
- A3
- Sheet Details
- N.T.S
- Sheet:
- Of:
- (in symbol OPA365AIDBVR) -; A; +

### Library data of the parts
C141 = 10pF / 50V / 5% / SMD 0603: Capacitor, Ceramic Chip, 10pF, 50V, 5%, SMD 0603 [LCA019]; Value: 10p; FMEDA__OPERATING__VOLTAGE_MAX: 3.3; FMEDA__OPERATING__VOLTAGE_MIN: 0; FMEDA__OPERATING__TEMP_MAX: 50; FMEDA__OPERATING__TEMP_MIN: -20; FMEDA__OPERATING__TEMP_TYP: 27; FMEDA__CHANNEL: COM; FMEDA__OPERATING__VOLTAGE_TYP: 3.3; FMEDA__FUNCTION_IN_SYSTEM: *
C142 = 100nF / 50V / 10% / SMD 0603: as C113-C117 on sheet LPCB235 - SPI UART - GROUP B1; FMEDA__FUNCTION_IN_SYSTEM: *; FMEDA__OPERATING__VOLTAGE_TYP: 3.3
IC47 = OPA365AIDBVR: as IC39 on sheet LPCB235 - HE ISO CHANNEL; FMEDA__FUNCTION_IN_SYSTEM: *
IC48 = BZX84C3V6LT1G: Diode, Zener, 3.6V, 0.225W, SMD [LIC083]; FMEDA__OPERATING__TEMP_MAX: 50; FMEDA__OPERATING__TEMP_MIN: -20; FMEDA__OPERATING__TEMP_TYP: 27; FMEDA__OPERATING__VOLTAGE_MAX: 0; FMEDA__CHANNEL: COM; Revision: 17-Jul-2002: Re-released for DXP Platform.; FMEDA__FUNCTION_IN_SYSTEM: *; FMEDA__OPERATING__VOLTAGE_MIN: 0; FMEDA__OPERATING__VOLTAGE_TYP: 0; FMEDA__OPERATING__CURRENT_MAX: 0; FMEDA__OPERATING__CURRENT_MIN: 0; FMEDA__OPERATING__CURRENT_TYP: 0
R22 = 162R / 0.33W / 1% / SMD 1210: Resistor, Ceramic Chip, 162R, 0.33W, 1%, SMD 1210 [LRE228]; VALUE: 162; FMEDA__OPERATING__POWER_MAX: 0; FMEDA__OPERATING__TEMP_MAX: 50; FMEDA__OPERATING__TEMP_MIN: -20; FMEDA__OPERATING__TEMP_TYP: 27; FMEDA__CHANNEL: COM; FMEDA__OPERATING__POWER_MIN: 0; FMEDA__OPERATING__VOLTAGE_MAX: 0; FMEDA__OPERATING__VOLTAGE_MIN: 0; FMEDA__OPERATING__VOLTAGE_TYP: 0; FMEDA__FUNCTION_IN_SYSTEM: *
R91 = 1.78K / 0.1W / 1% / 50V / SMD 0603: Resistor, Ceramic Chip, 1.78K, 0.1W, 1%, SMD 0603 [LRE167]; FMEDA__OPERATING__POWER_MAX: 0.01; FMEDA__OPERATING__POWER_MIN: 0; FMEDA__OPERATING__TEMP_MAX: 50; FMEDA__OPERATING__TEMP_MIN: -20; FMEDA__OPERATING__TEMP_TYP: 27; FMEDA__CHANNEL: COM; Value: 1.78K; FMEDA__OPERATING__VOLTAGE_MAX: 0; FMEDA__OPERATING__VOLTAGE_MIN: 0; FMEDA__OPERATING__VOLTAGE_TYP: 0; FMEDA__FUNCTION_IN_SYSTEM: *
R92 = 3.3K / 0.1W / 1% / SMD 0603: Resistor, Ceramic Chip, 3.3K0, 0.1W, 1%, SMD 0603 [LRE140]; FMEDA__OPERATING__POWER_MAX: 0; FMEDA__OPERATING__TEMP_MAX: 50; FMEDA__OPERATING__TEMP_MIN: -20; FMEDA__OPERATING__TEMP_TYP: 27; FMEDA__CHANNEL: COM; Value: 3.3K; FMEDA__OPERATING__POWER_MIN: 0; FMEDA__OPERATING__VOLTAGE_MAX: 0; FMEDA__OPERATING__VOLTAGE_MIN: 0; FMEDA__OPERATING__VOLTAGE_TYP: 0; FMEDA__FUNCTION_IN_SYSTEM: *